# EAGLE schematic DELTA_7_25_2016 (EAGLE 6.3), part 1 of 2

## Sheet 1 of 13
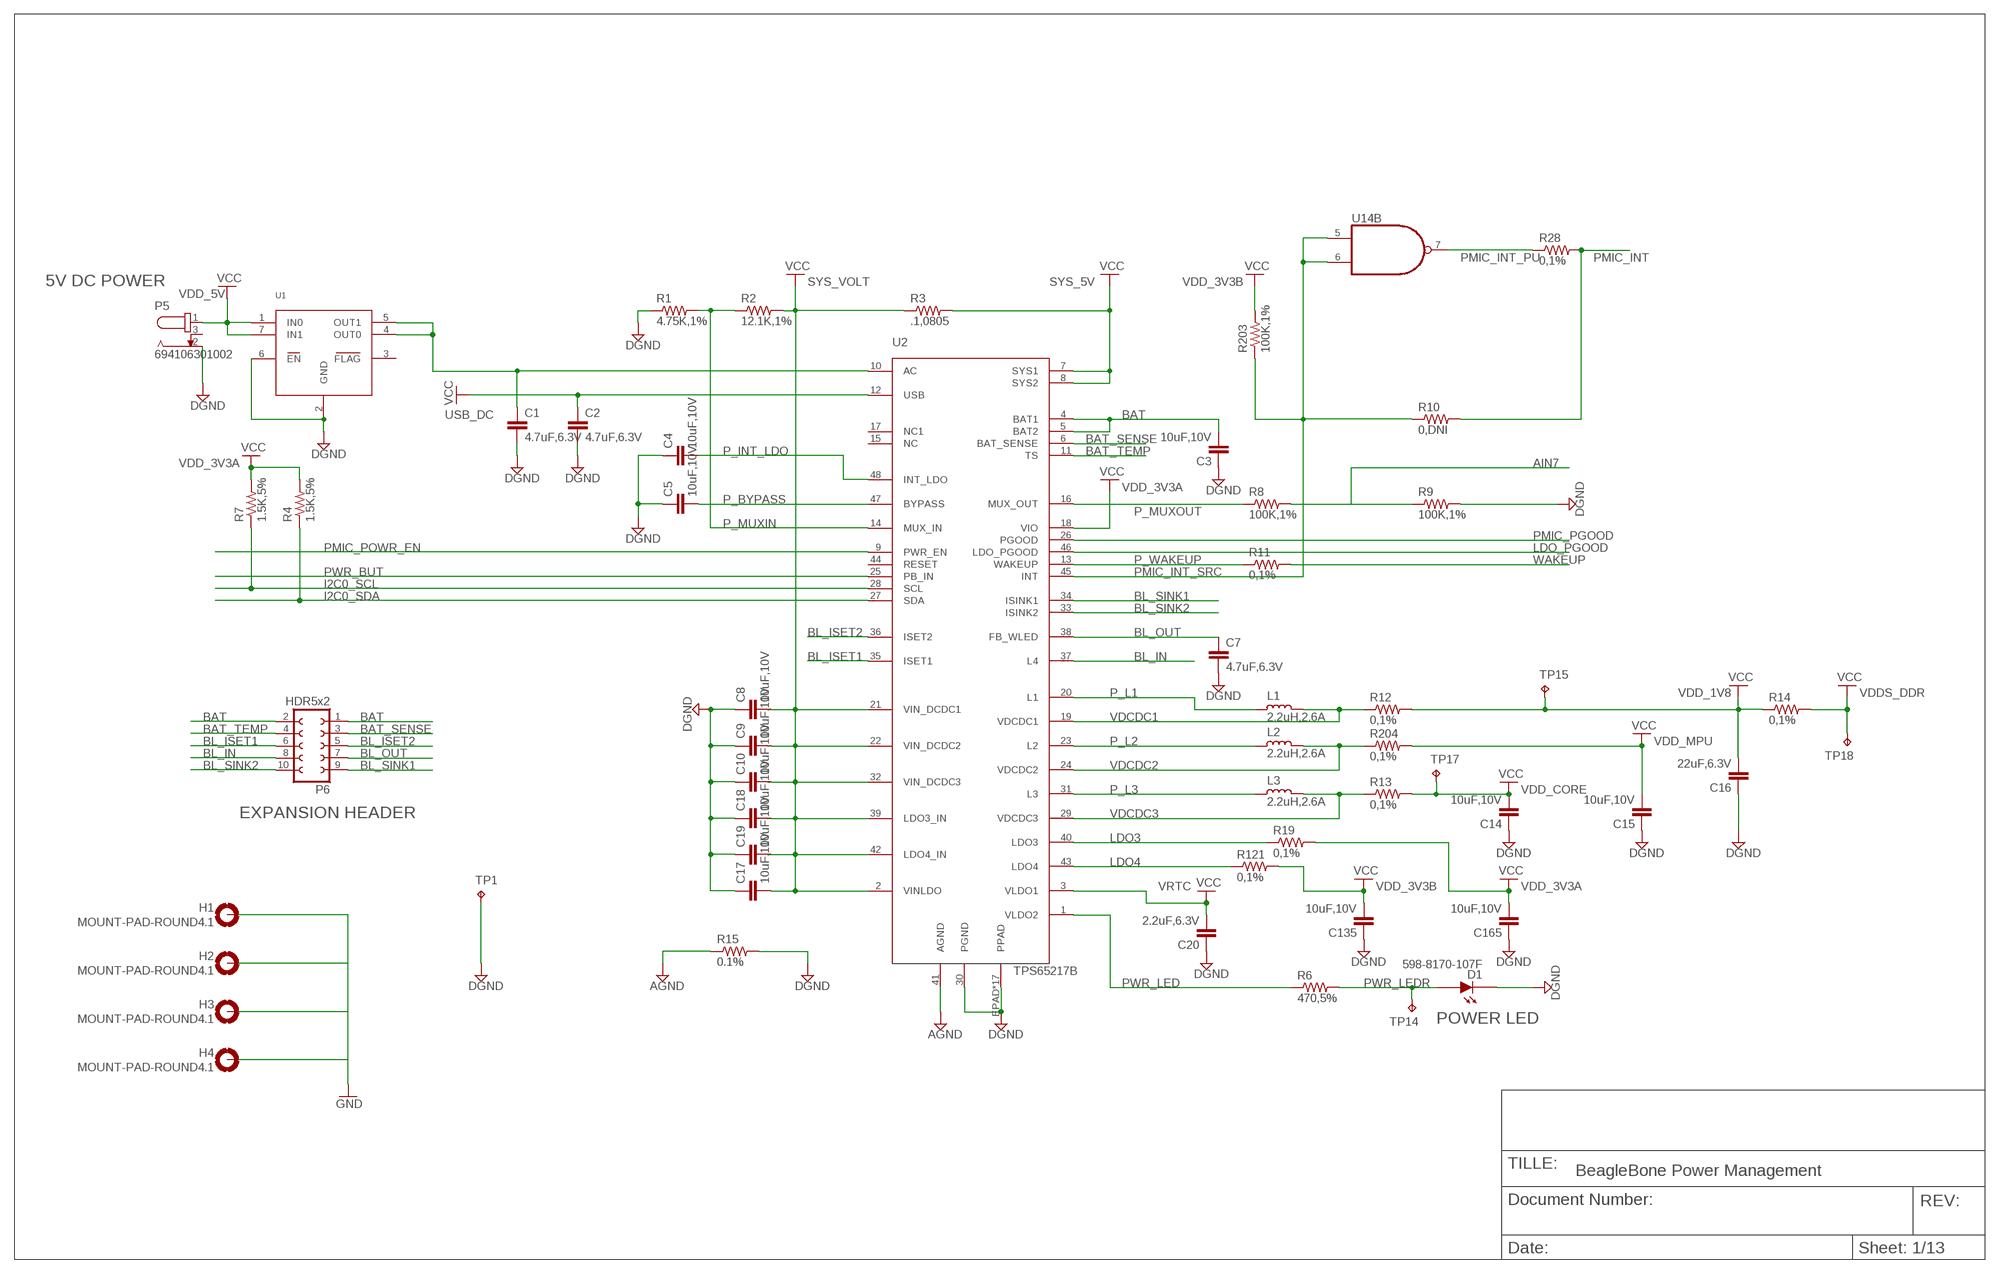
[diagram p0: schematic, sheet 1]

### Parts
C1  4.7uF,6.3V  C-EUC0402  [C0402]
C2  4.7uF,6.3V  C-EUC0402  [C0402]
C3  10uF,10V  C-EUC0402  [C0402]
C4  10uF,10V  C-EUC0402  [C0402]
C5  10uF,10V  C-EUC0402  [C0402]
C7  4.7uF,6.3V  C-EUC0402  [C0402]
C8  10uF,10V  C-EUC0402  [C0402]
C9  10uF,10V  C-EUC0402  [C0402]
C10  10uF,10V  C-EUC0402  [C0402]
C14  10uF,10V  C-EUC0402  [C0402]
C15  10uF,10V  C-EUC0402  [C0402]
C16  22uF,6.3V  C-EUC0402  [C0402]
C17  10uF,10V  C-EUC0402  [C0402]
C18  10uF,10V  C-EUC0402  [C0402]
C19  10uF,10V  C-EUC0402  [C0402]
C20  2.2uF,6.3V  C-EUC0402  [C0402]
C135  10uF,10V  C-EUC0402  [C0402]
C165  10uF,10V  C-EUC0402  [C0402]
D1  598-8170-107F  LEDC  [0805P]
H1  MOUNT-PAD-ROUND4.1  [4,1-PAD]
H2  MOUNT-PAD-ROUND4.1  [4,1-PAD]
H3  MOUNT-PAD-ROUND4.1  [4,1-PAD]
H4  MOUNT-PAD-ROUND4.1  [4,1-PAD]
L1  2.2uH,2.6A  L-EUL1008  [L1008]
L2  2.2uH,2.6A  L-EUL1008  [L1008]
L3  2.2uH,2.6A  L-EUL1008  [L1008]
P5  694106301002  [694106301002]
P6  HDR5x2  FE05-2  [FE05-2]
R1  4.75K,1%  R-US_R0402  [R0402]
R2  12.1K,1%  R-US_R0402  [R0402]
R3  .1,0805  R-US_R0402  [R0402]
R4  1.5K,5%  R-US_R0402  [R0402]
R6  470,5%  R-US_R0402  [R0402]
R7  1.5K,5%  R-US_R0402  [R0402]
R8  100K,1%  R-US_R0402  [R0402]
R9  100K,1%  R-US_R0402  [R0402]
R10  0,DNI  R-US_R0402  [R0402]
R11  0,1%  R-US_R0402  [R0402]
R12  0,1%  R-US_R0402  [R0402]
R13  0,1%  R-US_R0402  [R0402]
R14  0,1%  R-US_R0402  [R0402]
R15  0.1%  R-US_R0402  [R0402]
R19  0,1%  R-US_R0402  [R0402]
R28  0,1%  R-US_R0402  [R0402]
R121  0,1%  R-US_R0402  [R0402]
R203  100K,1%  R-US_R0402  [R0402]
R204  0,1%  R-US_R0402  [R0402]
TP1  TPB1,27  [B1,27]
TP14  TPB1,27  [B1,27]
TP15  TPB1,27  [B1,27]
TP17  TPB1,27  [B1,27]
TP18  TPB1,27  [B1,27]
U1  NCP349  [DFN6]
U2  TPS65217B  [RSL(S-PVQFN-N48)]
U14  SN74LVC2G00DCU  [DCU(S-PDSO-G8)]

### Nets
AGND: R15.1 U2.41(AGND)
AIN7: R8.2 R9.1 ; also sheet 4
BAT: C3.2 P6.1 P6.2 U2.4(BAT1) U2.5(BAT2)
BAT_SENSE: P6.3 U2.6(BAT_SENSE)
BAT_TEMP: P6.4 U2.11(TS)
BL_IN: P6.8 U2.37(L4)
BL_ISET1: P6.6 U2.35(ISET1)
BL_ISET2: P6.5 U2.36(ISET2)
BL_OUT: C7.1 P6.7 U2.38(FB_WLED)
BL_SINK1: P6.9 U2.34(ISINK1)
BL_SINK2: P6.10 U2.33(ISINK2)
DGND: C1.2 C2.2 C3.1 C4.1 C5.1 C7.2 C8.1 C9.1 C10.1 C14.1 C15.1 C16.1 C17.1 C18.1 C19.1 C20.1 C135.1 C165.1 D1.2(D_OUT) P5.2 R1.1 R9.2 R15.2 TP1.TP U1.2(GND) U1.6(EN) U2.30(PGND) U2.EPAD(PPAD) U2.P$1(PPAD) U2.P$2(PPAD) U2.P$3(PPAD) U2.P$4(PPAD) U2.P$5(PPAD) U2.P$6(PPAD) U2.P$7(PPAD) U2.P$8(PPAD) U2.P$9(PPAD) U2.P$10(PPAD) U2.P$11(PPAD) U2.P$12(PPAD) U2.P$13(PPAD) U2.P$14(PPAD) U2.P$15(PPAD) U2.P$16(PPAD) ; also sheet 2,3,5,6,7,8,9,10,11,12,13
GND: H1.B4,1(MOUNT) H2.B4,1(MOUNT) H3.B4,1(MOUNT) H4.B4,1(MOUNT) ; also sheet 7,8,10,11
I2C0_SCL: R7.1 U2.28(SCL) ; also sheet 4,6,11
I2C0_SDA: R4.1 U2.27(SDA) ; also sheet 4,6,11
LDO3: R19.1 U2.40(LDO3)
LDO4: R121.1 U2.43(LDO4)
LDO_PGOOD: U2.46(LDO_PGOOD) ; also sheet 3
N$12: C1.1 U1.4(OUT0) U1.5(OUT1) U2.10(AC)
P_BYPASS: C5.2 U2.47(BYPASS)
P_INT_LDO: C4.2 U2.48(INT_LDO)
P_L1: L1.2 U2.20(L1)
P_L2: L2.2 U2.23(L2)
P_L3: L3.2 U2.31(L3)
P_MUXIN: R1.2 R2.1 U2.14(MUX_IN)
P_MUXOUT: R8.1 U2.16(MUX_OUT)
P_WAKEUP: R11.1 U2.13(WAKEUP)
PMIC_INT: R10.2 R28.2 ; also sheet 3
PMIC_INT_PU: R28.1 U14.7(B:O)
PMIC_INT_SRC: R10.1 R203.1 U2.45(INT) U14.5(B:I0) U14.6(B:I1)
PMIC_PGOOD: U2.26(PGOOD) ; also sheet 3
PMIC_POWR_EN: U2.9(PWR_EN) ; also sheet 4
PWR_BUT: U2.25(PB_IN) ; also sheet 10
PWR_LED: R6.1 U2.1(VLDO2)
PWR_LEDR: D1.1(D_IN) R6.2 TP14.TP
SYS_5V: R3.2 U2.7(SYS1) U2.8(SYS2) ; supply symbol labelled VCC ; also sheet 5,7,8,10,11
SYS_VOLT: C8.2 C9.2 C10.2 C17.2 C18.2 C19.2 R2.2 R3.1 U2.2(VINLDO) U2.21(VIN_DCDC1) U2.22(VIN_DCDC2) U2.32(VIN_DCDC3) U2.39(LDO3_IN) U2.42(LDO4_IN) ; supply symbol labelled VCC ; also sheet 10
USB_DC: C2.1 U2.12(USB) ; supply symbol labelled VCC ; also sheet 8
VDCDC1: L1.1 R12.1 U2.19(VDCDC1)
VDCDC2: L2.1 R204.1 U2.24(VDCDC2)
VDCDC3: L3.1 R13.1 U2.29(VDCDC3)
VDD_1V8: C16.2 R12.2 R14.1 TP15.TP ; supply symbol labelled VCC ; also sheet 2,11
VDD_3V3A: C165.2 R4.2 R7.2 R19.2 U2.18(VIO) ; supply symbol labelled VCC ; also sheet 2,3,5,10
VDD_3V3B: C135.2 R121.2 R203.2 ; supply symbol labelled VCC ; also sheet 4,6,7,8,9,10,11,13
VDD_5V: P5.1 U1.1(IN0) U1.7(IN1) ; supply symbol labelled VCC ; also sheet 10
VDD_CORE: C14.2 R13.2 TP17.TP ; supply symbol labelled VCC ; also sheet 2
VDD_MPU: C15.2 R204.2 ; supply symbol labelled VCC ; also sheet 2
VDDS_DDR: R14.2 TP18.TP ; supply symbol labelled VCC ; also sheet 2,3,6,12
VRTC: C20.2 U2.3(VLDO1) ; supply symbol labelled VCC ; also sheet 2,3,4
WAKEUP: R11.2 ; also sheet 4
Unconnected: P5.3 U1.3(FLAG) U2.15(NC) U2.17(NC1) U2.44(RESET)

### Notes on the sheet
- 5V DC POWER
- EXPANSION HEADER
- POWER LED
- TILLE:
- BeagleBone Power Management
- Document Number: | REV:
- Date: | Sheet: 1/13

## Sheet 2 of 13
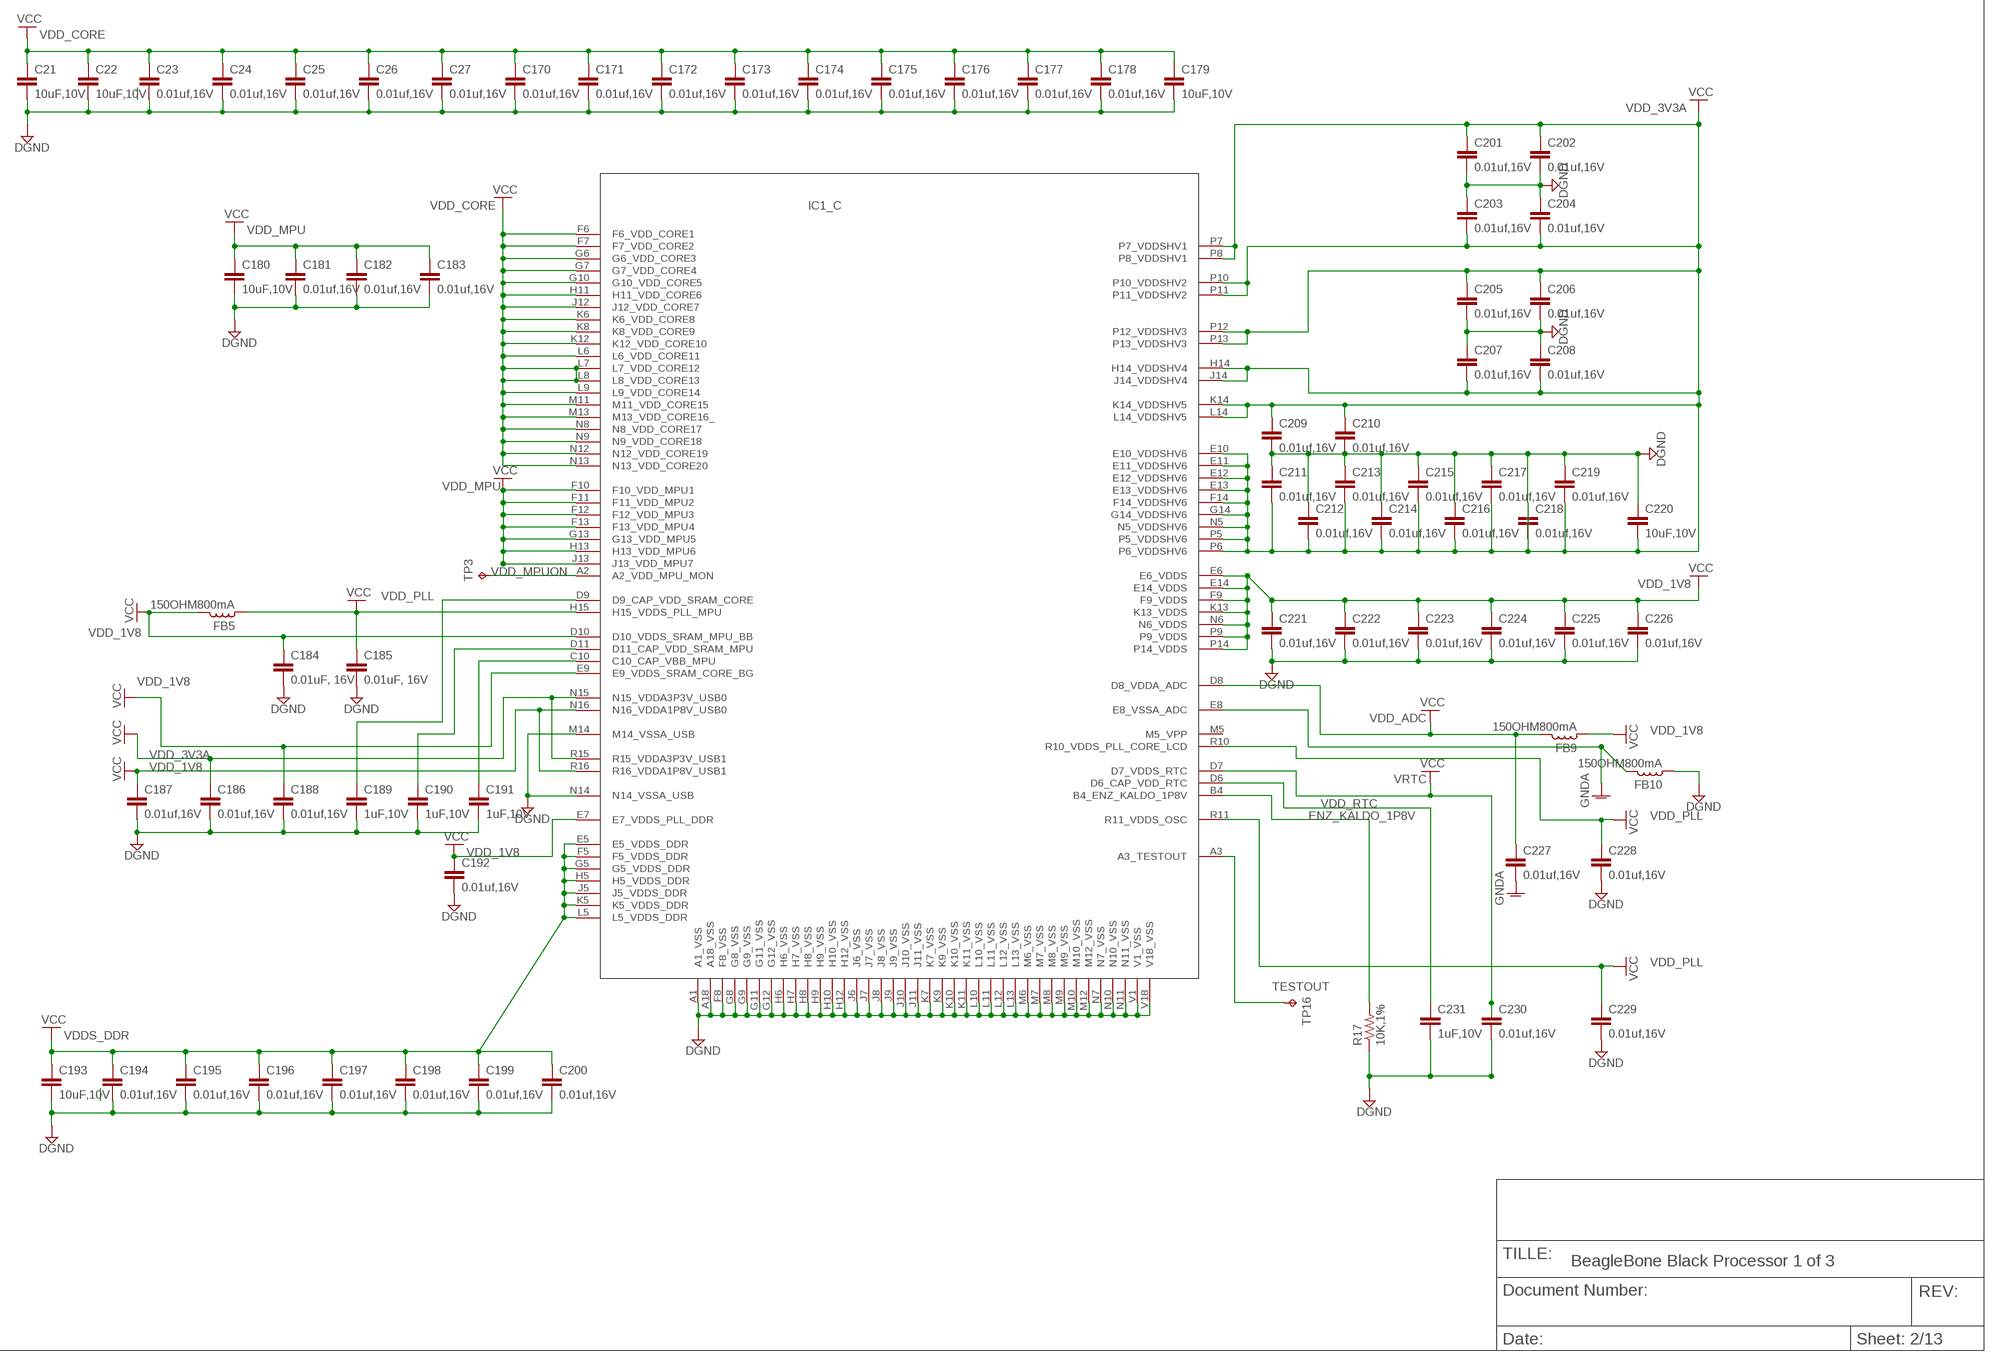
[diagram p1: schematic, sheet 2]

### Parts
C21  10uF,10V  C-EUC0402  [C0402]
C22  10uF,10V  C-EUC0402  [C0402]
C23  0.01uf,16V  C-EUC0402  [C0402]
C24  0.01uf,16V  C-EUC0402  [C0402]
C25  0.01uf,16V  C-EUC0402  [C0402]
C26  0.01uf,16V  C-EUC0402  [C0402]
C27  0.01uf,16V  C-EUC0402  [C0402]
C170  0.01uf,16V  C-EUC0402  [C0402]
C171  0.01uf,16V  C-EUC0402  [C0402]
C172  0.01uf,16V  C-EUC0402  [C0402]
C173  0.01uf,16V  C-EUC0402  [C0402]
C174  0.01uf,16V  C-EUC0402  [C0402]
C175  0.01uf,16V  C-EUC0402  [C0402]
C176  0.01uf,16V  C-EUC0402  [C0402]
C177  0.01uf,16V  C-EUC0402  [C0402]
C178  0.01uf,16V  C-EUC0402  [C0402]
C179  10uF,10V  C-EUC0402  [C0402]
C180  10uF,10V  C-EUC0402  [C0402]
C181  0.01uf,16V  C-EUC0402  [C0402]
C182  0.01uf,16V  C-EUC0402  [C0402]
C183  0.01uf,16V  C-EUC0402  [C0402]
C184  0.01uF, 16V  C-EUC0402  [C0402]
C185  0.01uF, 16V  C-EUC0402  [C0402]
C186  0.01uf,16V  C-EUC0402  [C0402]
C187  0.01uf,16V  C-EUC0402  [C0402]
C188  0.01uf,16V  C-EUC0402  [C0402]
C189  1uF,10V  C-EUC0402  [C0402]
C190  1uF,10V  C-EUC0402  [C0402]
C191  1uF,10V  C-EUC0402  [C0402]
C192  0.01uf,16V  C-EUC0402  [C0402]
C193  10uF,10V  C-EUC0402  [C0402]
C194  0.01uf,16V  C-EUC0402  [C0402]
C195  0.01uf,16V  C-EUC0402  [C0402]
C196  0.01uf,16V  C-EUC0402  [C0402]
C197  0.01uf,16V  C-EUC0402  [C0402]
C198  0.01uf,16V  C-EUC0402  [C0402]
C199  0.01uf,16V  C-EUC0402  [C0402]
C200  0.01uf,16V  C-EUC0402  [C0402]
C201  0.01uf,16V  C-EUC0402  [C0402]
C202  0.01uf,16V  C-EUC0402  [C0402]
C203  0.01uf,16V  C-EUC0402  [C0402]
C204  0.01uf,16V  C-EUC0402  [C0402]
C205  0.01uf,16V  C-EUC0402  [C0402]
C206  0.01uf,16V  C-EUC0402  [C0402]
C207  0.01uf,16V  C-EUC0402  [C0402]
C208  0.01uf,16V  C-EUC0402  [C0402]
C209  0.01uf,16V  C-EUC0402  [C0402]
C210  0.01uf,16V  C-EUC0402  [C0402]
C211  0.01uf,16V  C-EUC0402  [C0402]
C212  0.01uf,16V  C-EUC0402  [C0402]
C213  0.01uf,16V  C-EUC0402  [C0402]
C214  0.01uf,16V  C-EUC0402  [C0402]
C215  0.01uf,16V  C-EUC0402  [C0402]
C216  0.01uf,16V  C-EUC0402  [C0402]
C217  0.01uf,16V  C-EUC0402  [C0402]
C218  0.01uf,16V  C-EUC0402  [C0402]
C219  0.01uf,16V  C-EUC0402  [C0402]
C220  10uF,10V  C-EUC0402  [C0402]
C221  0.01uf,16V  C-EUC0402  [C0402]
C222  0.01uf,16V  C-EUC0402  [C0402]
C223  0.01uf,16V  C-EUC0402  [C0402]
C224  0.01uf,16V  C-EUC0402  [C0402]
C225  0.01uf,16V  C-EUC0402  [C0402]
C226  0.01uf,16V  C-EUC0402  [C0402]
C227  0.01uf,16V  C-EUC0402  [C0402]
C228  0.01uf,16V  C-EUC0402  [C0402]
C229  0.01uf,16V  C-EUC0402  [C0402]
C230  0.01uf,16V  C-EUC0402  [C0402]
C231  1uF,10V  C-EUC0402  [C0402]
FB5  150OHM800mA  L-USL0603  [L0603]
FB9  150OHM800mA  L-USL0603  [L0603]
FB10  150OHM800mA  L-USL1812  [L1812]
IC1  AM335X_ZCZ  [ZCZ_S-PBGA-N324]
R17  10K,1%  R-US_R0402  [R0402]
TP3  TPB1,27  [B1,27]
TP16  TPB1,27  [B1,27]

### Nets
DGND: C21.2 C22.2 C23.2 C24.2 C25.2 C26.2 C27.2 C170.2 C171.2 C172.2 C173.2 C174.2 C175.2 C176.2 C177.2 C178.2 C179.2 C180.2 C181.2 C182.2 C183.2 C184.2 C185.2 C186.2 C187.2 C188.2 C189.2 C190.2 C191.2 C192.2 C193.2 C194.2 C195.2 C196.2 C197.2 C198.2 C199.2 C200.2 C201.2 C202.2 C203.1 C204.1 C205.2 C206.2 C207.1 C208.1 C221.2 C222.2 C223.2 C224.2 C225.2 C226.2 C228.2 C229.2 C230.2 C231.2 FB10.2 IC1.A1(_C:A1_VSS) IC1.A18(_C:A18_VSS) IC1.F8(_C:F8_VSS) IC1.G8(_C:G8_VSS) IC1.G9(_C:G9_VSS) IC1.G11(_C:G11_VSS) IC1.G12(_C:G12_VSS) IC1.H6(_C:H6_VSS) IC1.H7(_C:H7_VSS) IC1.H8(_C:H8_VSS) IC1.H9(_C:H9_VSS) IC1.H10(_C:H10_VSS) IC1.H12(_C:H12_VSS) IC1.J6(_C:J6_VSS) IC1.J7(_C:J7_VSS) IC1.J8(_C:J8_VSS) IC1.J9(_C:J9_VSS) IC1.J10(_C:J10_VSS) IC1.J11(_C:J11_VSS) IC1.K7(_C:K7_VSS) IC1.K9(_C:K9_VSS) IC1.K10(_C:K10_VSS) IC1.K11(_C:K11_VSS) IC1.L10(_C:L10_VSS) IC1.L11(_C:L11_VSS) IC1.L12(_C:L12_VSS) IC1.L13(_C:L13_VSS) IC1.M6(_C:M6_VSS) IC1.M7(_C:M7_VSS) IC1.M8(_C:M8_VSS) IC1.M9(_C:M9_VSS) IC1.M10(_C:M10_VSS) IC1.M12(_C:M12_VSS) IC1.M14(_C:M14_VSSA_USB) IC1.N7(_C:N7_VSS) IC1.N10(_C:N10_VSS) IC1.N11(_C:N11_VSS) IC1.N14(_C:N14_VSSA_USB) IC1.V1(_C:V1_VSS) IC1.V18(_C:V18_VSS) R17.1 ; also sheet 1,3,5,6,7,8,9,10,11,12,13
ENZ_KALDO_1P8V: IC1.B4(_C:B4_ENZ_KALDO_1P8V) R17.2
GNDA: C227.2 FB10.1 IC1.E8(_C:E8_VSSA_ADC) ; also sheet 4,5
N$6: C189.1 IC1.D9(_C:D9_CAP_VDD_SRAM_CORE)
N$16: C190.1 IC1.D11(_C:D11_CAP_VDD_SRAM_MPU)
N$17: C191.1 IC1.C10(_C:C10_CAP_VBB_MPU)
TESTOUT: IC1.A3(_C:A3_TESTOUT) TP16.TP
VDD_1V8: C184.1 C187.1 C188.1 C192.1 C221.1 C222.1 C223.1 C224.1 C225.1 C226.1 FB5.1 FB9.2 IC1.D10(_C:D10_VDDS_SRAM_MPU_BB) IC1.E6(_C:E6_VDDS) IC1.E7(_C:E7_VDDS_PLL_DDR) IC1.E9(_C:E9_VDDS_SRAM_CORE_BG) IC1.E14(_C:E14_VDDS) IC1.F9(_C:F9_VDDS) IC1.K13(_C:K13_VDDS) IC1.N6(_C:N6_VDDS) IC1.N16(_C:N16_VDDA1P8V_USB0) IC1.P9(_C:P9_VDDS) IC1.P14(_C:P14_VDDS) IC1.R16(_C:R16_VDDA1P8V_USB1) ; supply symbol labelled VCC ; also sheet 1,11
VDD_3V3A: C186.1 C201.1 C202.1 C203.2 C204.2 C205.1 C206.1 C207.2 C208.2 C209.1 C209.2 C210.1 C210.2 C211.1 C211.2 C212.1 C212.2 C213.1 C213.2 C214.1 C214.2 C215.1 C215.2 C216.1 C216.2 C217.1 C217.2 C218.1 C218.2 C219.1 C219.2 C220.1 C220.2 IC1.E10(_C:E10_VDDSHV6) IC1.E11(_C:E11_VDDSHV6) IC1.E12(_C:E12_VDDSHV6) IC1.E13(_C:E13_VDDSHV6) IC1.F14(_C:F14_VDDSHV6) IC1.G14(_C:G14_VDDSHV6) IC1.H14(_C:H14_VDDSHV4) IC1.J14(_C:J14_VDDSHV4) IC1.K14(_C:K14_VDDSHV5) IC1.L14(_C:L14_VDDSHV5) IC1.N5(_C:N5_VDDSHV6) IC1.N15(_C:N15_VDDA3P3V_USB0) IC1.P5(_C:P5_VDDSHV6) IC1.P6(_C:P6_VDDSHV6) IC1.P7(_C:P7_VDDSHV1) IC1.P8(_C:P8_VDDSHV1) IC1.P10(_C:P10_VDDSHV2) IC1.P11(_C:P11_VDDSHV2) IC1.P12(_C:P12_VDDSHV3) IC1.P13(_C:P13_VDDSHV3) IC1.R15(_C:R15_VDDA3P3V_USB1) ; supply symbol labelled VCC, DGND ; also sheet 1,3,5,10
VDD_ADC: C227.1 FB9.1 IC1.D8(_C:D8_VDDA_ADC) ; supply symbol labelled VCC ; also sheet 4,10
VDD_CORE: C21.1 C22.1 C23.1 C24.1 C25.1 C26.1 C27.1 C170.1 C171.1 C172.1 C173.1 C174.1 C175.1 C176.1 C177.1 C178.1 C179.1 IC1.F6(_C:F6_VDD_CORE1) IC1.F7(_C:F7_VDD_CORE2) IC1.G6(_C:G6_VDD_CORE3) IC1.G7(_C:G7_VDD_CORE4) IC1.G10(_C:G10_VDD_CORE5) IC1.H11(_C:H11_VDD_CORE6) IC1.J12(_C:J12_VDD_CORE7) IC1.K6(_C:K6_VDD_CORE8) IC1.K8(_C:K8_VDD_CORE9) IC1.K12(_C:K12_VDD_CORE10) IC1.L6(_C:L6_VDD_CORE11) IC1.L7(_C:L7_VDD_CORE12) IC1.L8(_C:L8_VDD_CORE13) IC1.L9(_C:L9_VDD_CORE14) IC1.M11(_C:M11_VDD_CORE15) IC1.M13(_C:M13_VDD_CORE16_) IC1.N8(_C:N8_VDD_CORE17) IC1.N9(_C:N9_VDD_CORE18) IC1.N12(_C:N12_VDD_CORE19) IC1.N13(_C:N13_VDD_CORE20) ; supply symbol labelled VCC ; also sheet 1
VDD_MPU: C180.1 C181.1 C182.1 C183.1 IC1.F10(_C:F10_VDD_MPU1) IC1.F11(_C:F11_VDD_MPU2) IC1.F12(_C:F12_VDD_MPU3) IC1.F13(_C:F13_VDD_MPU4) IC1.G13(_C:G13_VDD_MPU5) IC1.H13(_C:H13_VDD_MPU6) IC1.J13(_C:J13_VDD_MPU7) ; supply symbol labelled VCC ; also sheet 1
VDD_MPUON: IC1.A2(_C:A2_VDD_MPU_MON) TP3.TP
VDD_PLL: C185.1 C228.1 C229.1 FB5.2 IC1.H15(_C:H15_VDDS_PLL_MPU) IC1.R10(_C:R10_VDDS_PLL_CORE_LCD) IC1.R11(_C:R11_VDDS_OSC) ; supply symbol labelled VCC
VDD_RTC: C231.1 IC1.D6(_C:D6_CAP_VDD_RTC)
VDDS_DDR: C193.1 C194.1 C195.1 C196.1 C197.1 C198.1 C199.1 C200.1 IC1.E5(_C:E5_VDDS_DDR) IC1.F5(_C:F5_VDDS_DDR) IC1.G5(_C:G5_VDDS_DDR) IC1.H5(_C:H5_VDDS_DDR) IC1.J5(_C:J5_VDDS_DDR) IC1.K5(_C:K5_VDDS_DDR) IC1.L5(_C:L5_VDDS_DDR) ; supply symbol labelled VCC ; also sheet 1,3,6,12
VRTC: C230.1 IC1.D7(_C:D7_VDDS_RTC) ; supply symbol labelled VCC ; also sheet 1,3,4
Unconnected: IC1.M5(_C:M5_VPP)

### Notes on the sheet
- TILLE:
- BeagleBone Black Processor 1 of 3
- Document Number: | REV:
- Date: | Sheet: 2/13

## Sheet 3 of 13
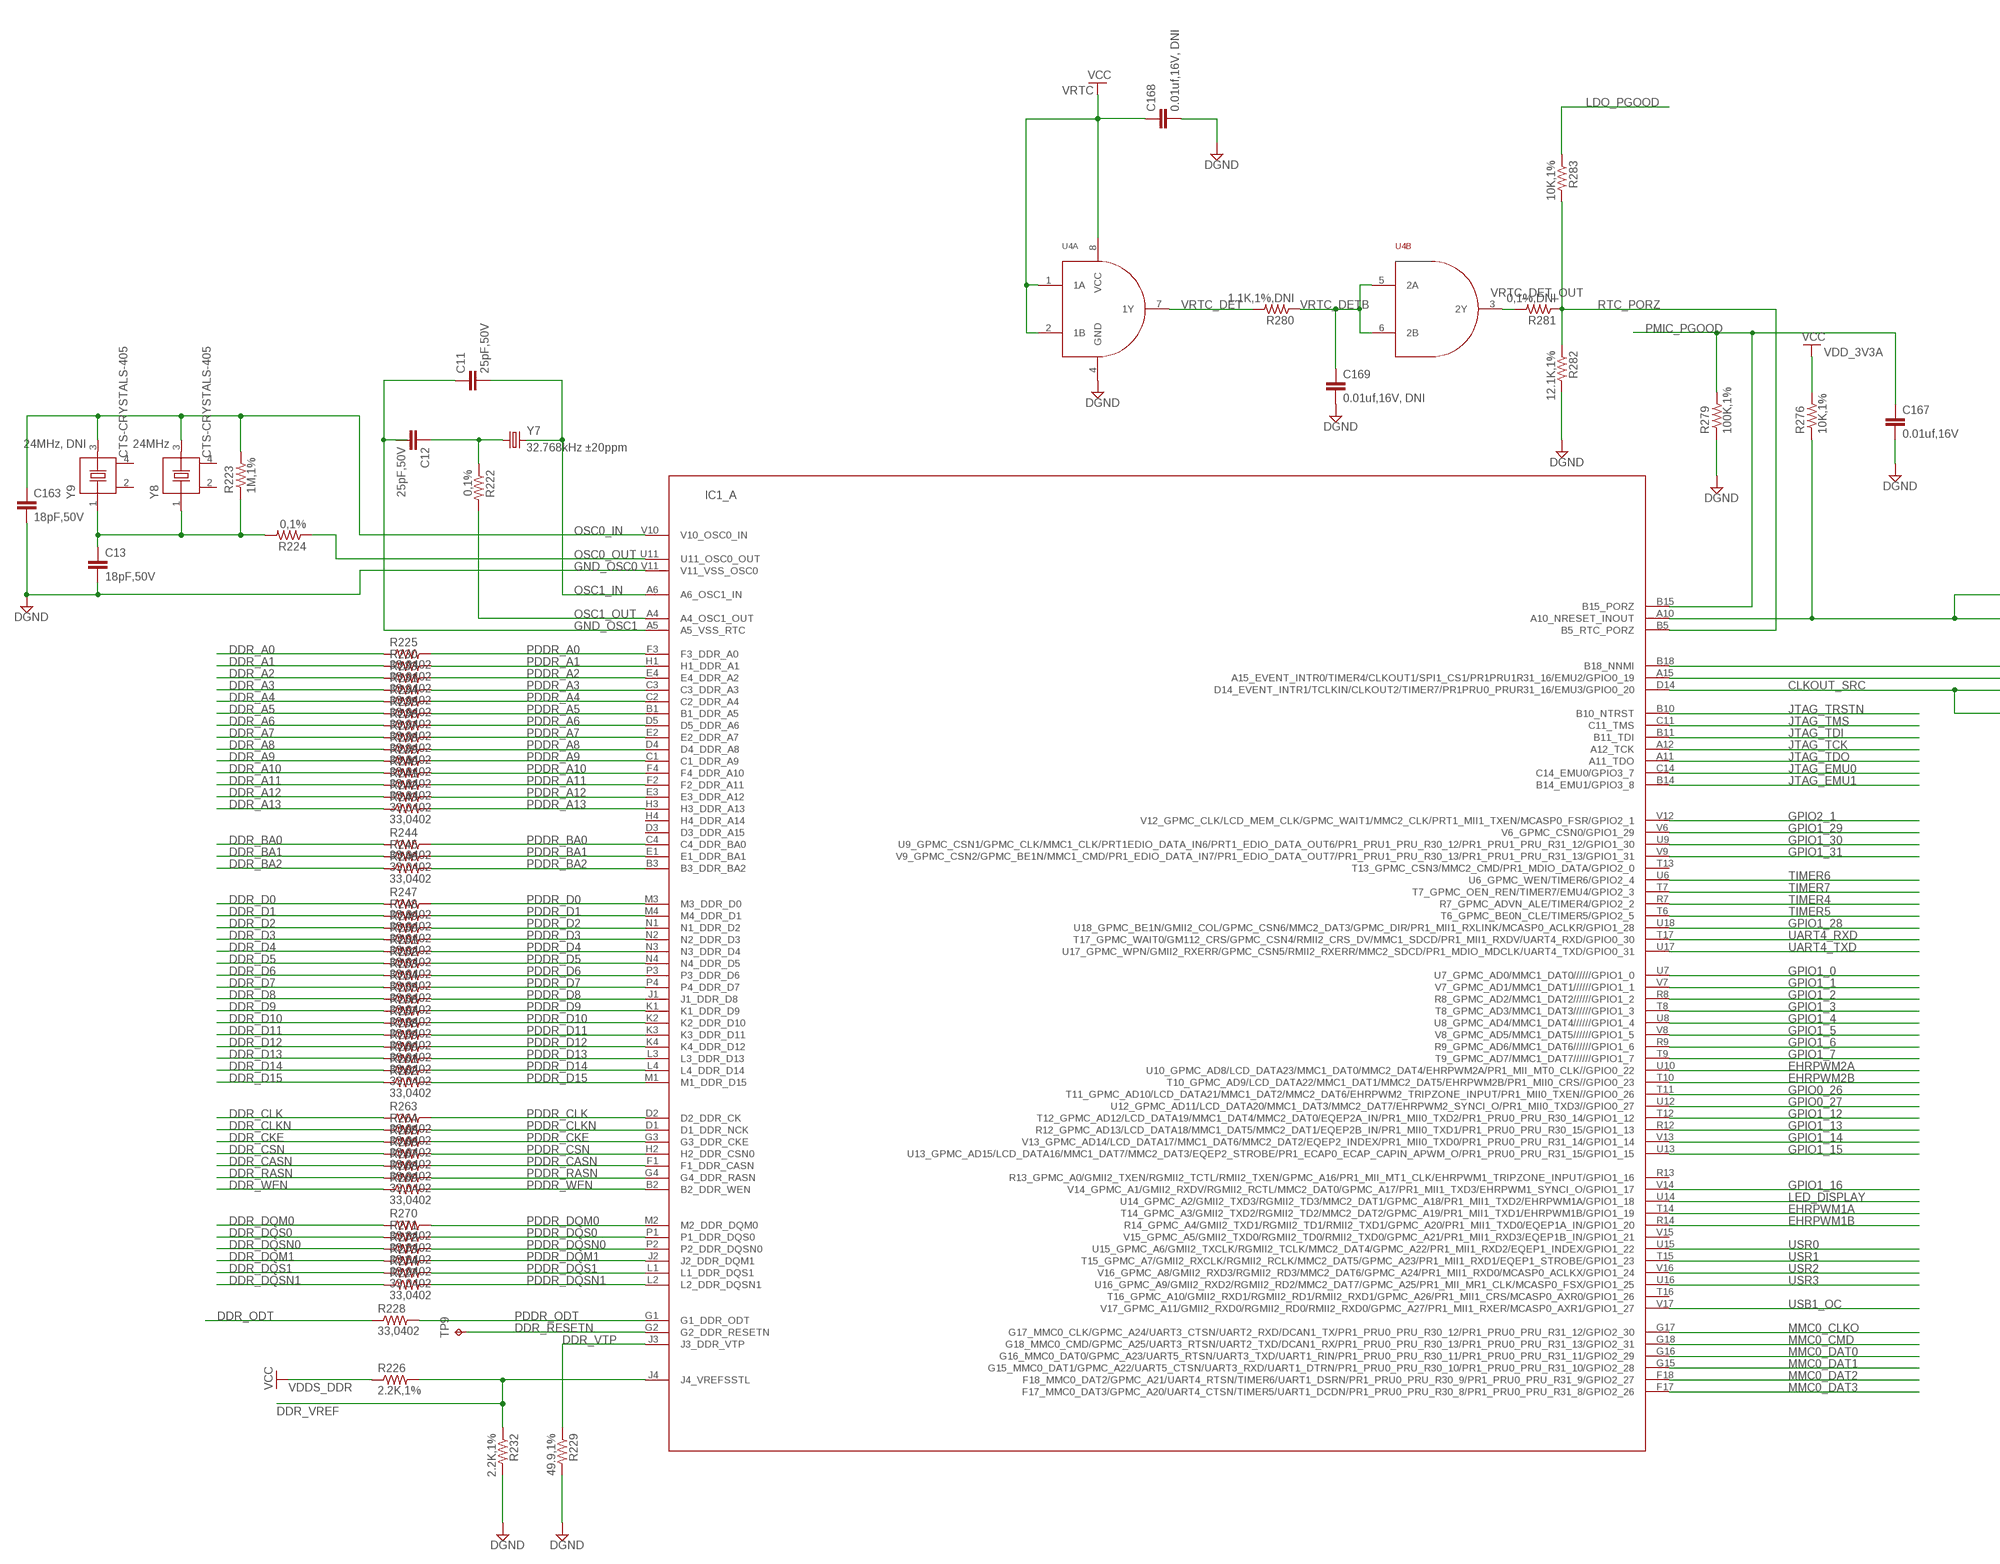
[diagram p2: schematic, sheet 3, part 1 of 2]
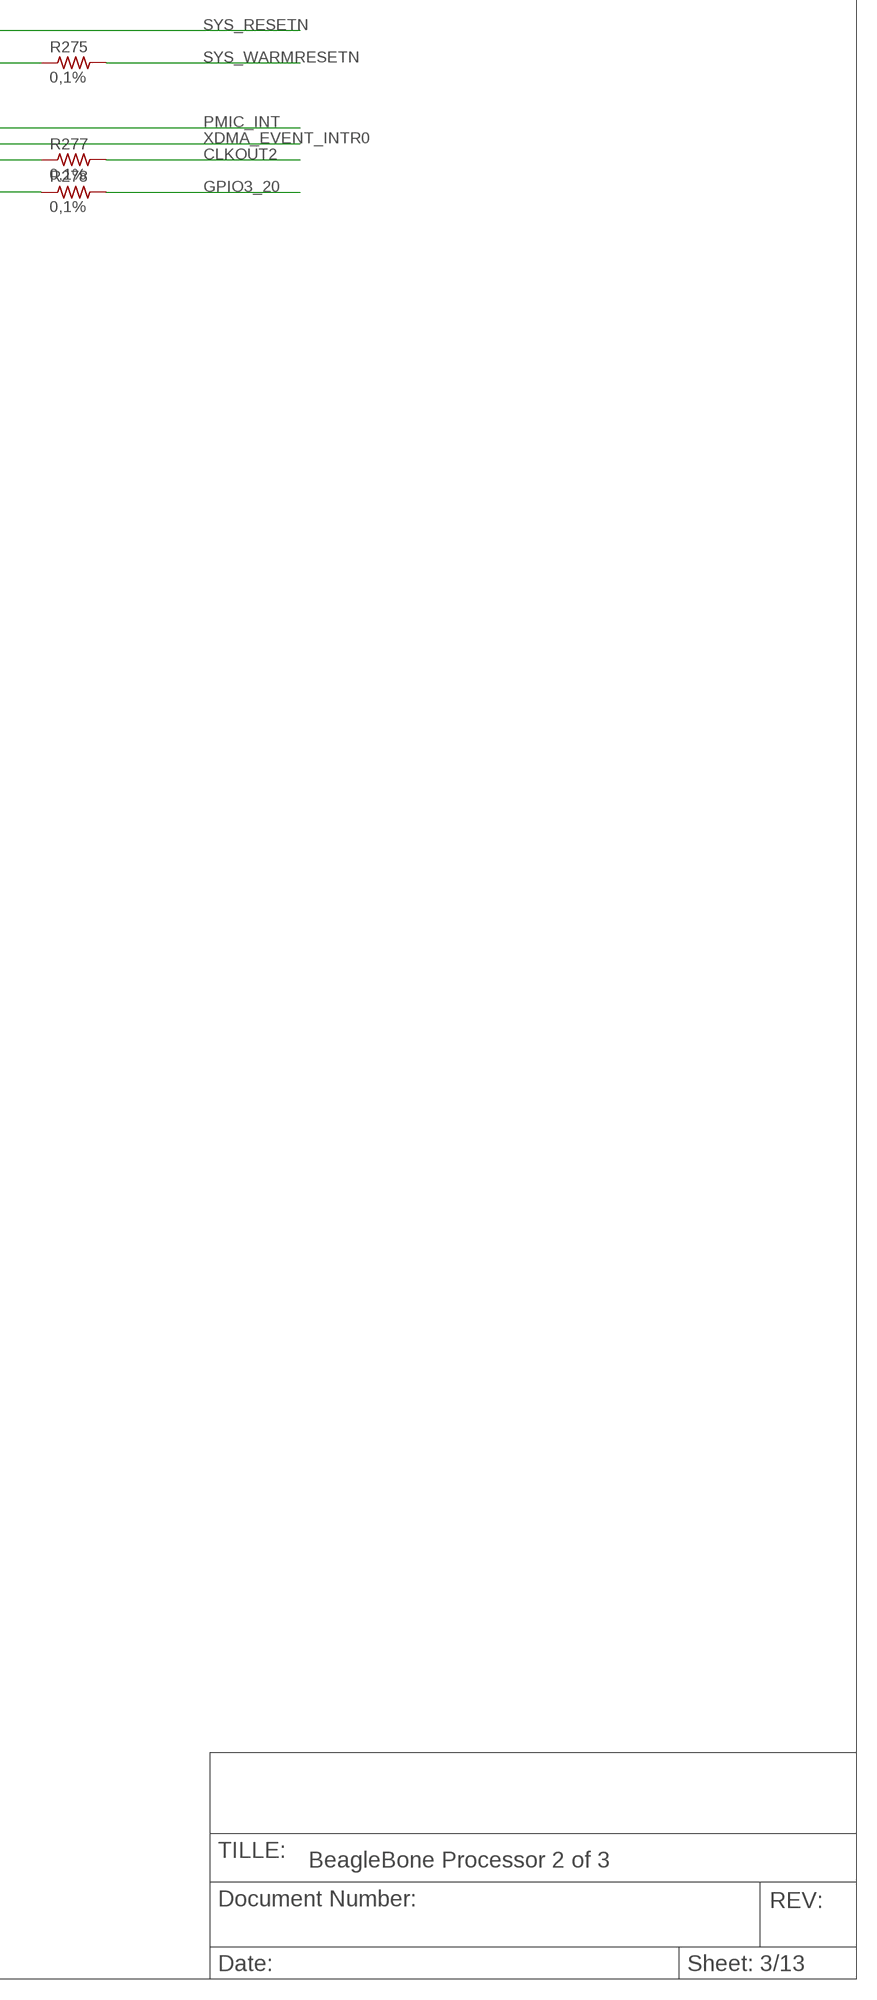
[diagram p3: schematic, sheet 3, part 2 of 2]

### Parts
C11  25pF,50V  C-EUC0603  [C0603]
C12  25pF,50V  C-EUC0603  [C0603]
C13  18pF,50V  C-EUC0402  [C0402]
C163  18pF,50V  C-EUC0402  [C0402]
C167  0.01uf,16V  C-EUC0402  [C0402]
C168  0.01uf,16V, DNI  C-EUC0402  [C0402]
C169  0.01uf,16V, DNI  C-EUC0402  [C0402]
R222  0,1%  R-US_R0402  [R0402]
R223  1M,1%  R-US_R0402  [R0402]
R224  0,1%  R-US_R0402  [R0402]
R225  33,0402  R-US_R0402  [R0402]
R226  2.2K,1%  R-US_R0402  [R0402]
R227  33,0402  R-US_R0402  [R0402]
R228  33,0402  R-US_R0402  [R0402]
R229  49.9,1%  R-US_R0402  [R0402]
R230  33,0402  R-US_R0402  [R0402]
R231  33,0402  R-US_R0402  [R0402]
R232  2.2K,1%  R-US_R0402  [R0402]
R233  33,0402  R-US_R0402  [R0402]
R234  33,0402  R-US_R0402  [R0402]
R235  33,0402  R-US_R0402  [R0402]
R236  33,0402  R-US_R0402  [R0402]
R237  33,0402  R-US_R0402  [R0402]
R238  33,0402  R-US_R0402  [R0402]
R239  33,0402  R-US_R0402  [R0402]
R240  33,0402  R-US_R0402  [R0402]
R241  33,0402  R-US_R0402  [R0402]
R242  33,0402  R-US_R0402  [R0402]
R243  33,0402  R-US_R0402  [R0402]
R244  33,0402  R-US_R0402  [R0402]
R245  33,0402  R-US_R0402  [R0402]
R246  33,0402  R-US_R0402  [R0402]
R247  33,0402  R-US_R0402  [R0402]
R248  33,0402  R-US_R0402  [R0402]
R249  33,0402  R-US_R0402  [R0402]
R250  33,0402  R-US_R0402  [R0402]
R251  33,0402  R-US_R0402  [R0402]
R252  33,0402  R-US_R0402  [R0402]
R253  33,0402  R-US_R0402  [R0402]
R254  33,0402  R-US_R0402  [R0402]
R255  33,0402  R-US_R0402  [R0402]
R256  33,0402  R-US_R0402  [R0402]
R257  33,0402  R-US_R0402  [R0402]
R258  33,0402  R-US_R0402  [R0402]
R259  33,0402  R-US_R0402  [R0402]
R260  33,0402  R-US_R0402  [R0402]
R261  33,0402  R-US_R0402  [R0402]
R262  33,0402  R-US_R0402  [R0402]
R263  33,0402  R-US_R0402  [R0402]
R264  33,0402  R-US_R0402  [R0402]
R265  33,0402  R-US_R0402  [R0402]
R266  33,0402  R-US_R0402  [R0402]
R267  33,0402  R-US_R0402  [R0402]
R268  33,0402  R-US_R0402  [R0402]
R269  33,0402  R-US_R0402  [R0402]
R270  33,0402  R-US_R0402  [R0402]
R271  33,0402  R-US_R0402  [R0402]
R272  33,0402  R-US_R0402  [R0402]
R273  33,0402  R-US_R0402  [R0402]
R274  33,0402  R-US_R0402  [R0402]
R275  0,1%  R-US_R0402  [R0402]
R276  10K,1%  R-US_R0402  [R0402]
R277  0,1%  R-US_R0402  [R0402]
R278  0,1%  R-US_R0402  [R0402]
R279  100K,1%  R-US_R0402  [R0402]
R280  1.1K,1%,DNI  R-US_R0402  [R0402]
R281  0,1%,DNI  R-US_R0402  [R0402]
R282  12.1K,1%  R-US_R0402  [R0402]
R283  10K,1%  R-US_R0402  [R0402]
TP9  TPB1,27  [B1,27]
U4  SN74AUP2G08,DNI  [DQE(R-PX2SON-N8),DNI]
Y7  32.768kHz ±20ppm  CRYSTALMC-306  [MC-306]
Y8  CTS-CRYSTALS-405  [CTS-405]
Y9  CTS-CRYSTALS-405  [CTS-405]

### Nets
CLKOUT2: R277.2 ; also sheet 9,10
CLKOUT_SRC: IC1.D14(_A:D14_EVENT_INTR1/TCLKIN/CLKOUT2/TIMER7/PR1PRU0_PRUR31_16/EMU3/GPIO0_20) R277.1 R278.1
DDR_A0: R225.1 ; also sheet 6,12
DDR_A1: R230.1 ; also sheet 6,12
DDR_A2: R233.1 ; also sheet 6,12
DDR_A3: R231.1 ; also sheet 6,12
DDR_A4: R234.1 ; also sheet 6,12
DDR_A5: R235.1 ; also sheet 6,12
DDR_A6: R236.1 ; also sheet 6,12
DDR_A7: R237.1 ; also sheet 6,12
DDR_A8: R238.1 ; also sheet 6,12
DDR_A9: R239.1 ; also sheet 6,12
DDR_A10: R240.1 ; also sheet 6,12
DDR_A11: R241.1 ; also sheet 6,12
DDR_A12: R242.1 ; also sheet 6,12
DDR_A13: R243.1 ; also sheet 6,12
DDR_BA0: R244.1 ; also sheet 6,12
DDR_BA1: R245.1 ; also sheet 6,12
DDR_BA2: R246.1 ; also sheet 6,12
DDR_CASN: R267.1 ; also sheet 6,12
DDR_CKE: R265.1 ; also sheet 6,12
DDR_CLK: R263.1 ; also sheet 6,12
DDR_CLKN: R264.1 ; also sheet 6,12
DDR_CSN: R266.1 ; also sheet 6,12
DDR_D0: R247.1 ; also sheet 6,12
DDR_D1: R248.1 ; also sheet 6,12
DDR_D2: R249.1 ; also sheet 6,12
DDR_D3: R250.1 ; also sheet 6,12
DDR_D4: R251.1 ; also sheet 6,12
DDR_D5: R252.1 ; also sheet 6,12
DDR_D6: R253.1 ; also sheet 6,12
DDR_D7: R254.1 ; also sheet 6,12
DDR_D8: R255.1 ; also sheet 6,12
DDR_D9: R256.1 ; also sheet 6,12
DDR_D10: R257.1 ; also sheet 6,12
DDR_D11: R258.1 ; also sheet 6,12
DDR_D12: R259.1 ; also sheet 6,12
DDR_D13: R260.1 ; also sheet 6,12
DDR_D14: R261.1 ; also sheet 6,12
DDR_D15: R262.1 ; also sheet 6,12
DDR_DQM0: R270.1 ; also sheet 6,12
DDR_DQM1: R273.1 ; also sheet 6,12
DDR_DQS0: R271.1 ; also sheet 6,12
DDR_DQS1: R274.1 ; also sheet 6,12
DDR_DQSN0: R272.1 ; also sheet 6,12
DDR_DQSN1: R227.1 ; also sheet 6,12
DDR_ODT: R228.1 ; also sheet 6,12
DDR_RASN: R268.1 ; also sheet 6,12
DDR_RESETN: IC1.G2(_A:G2_DDR_RESETN) TP9.TP ; also sheet 12
DDR_VREF: IC1.J4(_A:J4_VREFSSTL) R226.2 R232.1 ; also sheet 6,12
DDR_VTP: IC1.J3(_A:J3_DDR_VTP) R229.1
DDR_WEN: R269.1 ; also sheet 6,12
DGND: C167.2 C168.2 C169.2 R229.2 R232.2 R279.1 R282.2 U4.4(A:GND) ; also sheet 1,2,5,6,7,8,9,10,11,12,13
EHRPWM1A: IC1.T14(_A:T14_GPMC_A3/GMII2_TXD2/RGMII2_TD2/MMC2_DAT2/GPMC_A19/PR1_MII1_TXD1/EHRPWM1B/GPIO1_19) ; also sheet 10
EHRPWM1B: IC1.R14(_A:R14_GPMC_A4/GMII2_TXD1/RGMII2_TD1/RMII2_TXD1/GPMC_A20/PR1_MII1_TXD0/EQEP1A_IN/GPIO1_20) ; also sheet 10
EHRPWM2A: IC1.U10(_A:U10_GPMC_AD8/LCD_DATA23/MMC1_DAT0/MMC2_DAT4/EHRPWM2A/PR1_MII_MT0_CLK//GPIO0_22) ; also sheet 10
EHRPWM2B: IC1.T10(_A:T10_GPMC_AD9/LCD_DATA22/MMC1_DAT1/MMC2_DAT5/EHRPWM2B/PR1_MII0_CRS//GPIO0_23) ; also sheet 10
GND_OSC0: C13.2 C163.2 IC1.V11(_A:V11_VSS_OSC0) ; supply symbol labelled DGND
GND_OSC1: C11.1 C12.2 IC1.A5(_A:A5_VSS_RTC)
GPIO0_26: IC1.T11(_A:T11_GPMC_AD10/LCD_DATA21/MMC1_DAT2/MMC2_DAT6/EHRPWM2_TRIPZONE_INPUT/PR1_MII0_TXEN//GPIO0_26) ; also sheet 10
GPIO0_27: IC1.U12(_A:U12_GPMC_AD11/LCD_DATA20/MMC1_DAT3/MMC2_DAT7/EHRPWM2_SYNCI_O/PR1_MII0_TXD3//GPIO0_27) ; also sheet 10
GPIO1_0: IC1.U7(_A:U7_GPMC_AD0/MMC1_DAT0//////GPIO1_0) ; also sheet 10
GPIO1_1: IC1.V7(_A:V7_GPMC_AD1/MMC1_DAT1//////GPIO1_1) ; also sheet 10
GPIO1_2: IC1.R8(_A:R8_GPMC_AD2/MMC1_DAT2//////GPIO1_2) ; also sheet 10
GPIO1_3: IC1.T8(_A:T8_GPMC_AD3/MMC1_DAT3//////GPIO1_3) ; also sheet 10
GPIO1_4: IC1.U8(_A:U8_GPMC_AD4/MMC1_DAT4//////GPIO1_4) ; also sheet 10
GPIO1_5: IC1.V8(_A:V8_GPMC_AD5/MMC1_DAT5//////GPIO1_5) ; also sheet 10
GPIO1_6: IC1.R9(_A:R9_GPMC_AD6/MMC1_DAT6//////GPIO1_6) ; also sheet 10
GPIO1_7: IC1.T9(_A:T9_GPMC_AD7/MMC1_DAT7//////GPIO1_7) ; also sheet 10
GPIO1_12: IC1.T12(_A:T12_GPMC_AD12/LCD_DATA19/MMC1_DAT4/MMC2_DAT0/EQEP2A_IN/PR1_MII0_TXD2/PR1_PRU0_PRU_R30_14/GPIO1_12) ; also sheet 10
GPIO1_13: IC1.R12(_A:R12_GPMC_AD13/LCD_DATA18/MMC1_DAT5/MMC2_DAT1/EQEP2B_IN/PR1_MII0_TXD1/PR1_PRU0_PRU_R30_15/GPIO1_13) ; also sheet 10
GPIO1_14: IC1.V13(_A:V13_GPMC_AD14/LCD_DATA17/MMC1_DAT6/MMC2_DAT2/EQEP2_INDEX/PR1_MII0_TXD0/PR1_PRU0_PRU_R31_14/GPIO1_14) ; also sheet 10
GPIO1_15: IC1.U13(_A:U13_GPMC_AD15/LCD_DATA16/MMC1_DAT7/MMC2_DAT3/EQEP2_STROBE/PR1_ECAP0_ECAP_CAPIN_APWM_O/PR1_PRU0_PRU_R31_15/GPIO1_15) ; also sheet 10
GPIO1_16: IC1.V14(_A:V14_GPMC_A1/GMII2_RXDV/RGMII2_RCTL/MMC2_DAT0/GPMC_A17/PR1_MII1_TXD3/EHRPWM1_SYNCI_O/GPIO1_17) ; also sheet 10
GPIO1_28: IC1.U18(_A:U18_GPMC_BE1N/GMII2_COL/GPMC_CSN6/MMC2_DAT3/GPMC_DIR/PR1_MII1_RXLINK/MCASP0_ACLKR/GPIO1_28) ; also sheet 10
GPIO1_29: IC1.V6(_A:V6_GPMC_CSN0/GPIO1_29) ; also sheet 10
GPIO1_30: IC1.U9(_A:U9_GPMC_CSN1/GPMC_CLK/MMC1_CLK/PRT1EDIO_DATA_IN6/PRT1_EDIO_DATA_OUT6/PR1_PRU1_PRU_R30_12/PR1_PRU1_PRU_R31_12/GPIO1_30) ; also sheet 10
GPIO1_31: IC1.V9(_A:V9_GPMC_CSN2/GPMC_BE1N/MMC1_CMD/PR1_EDIO_DATA_IN7/PR1_EDIO_DATA_OUT7/PR1_PRU1_PRU_R30_13/PR1_PRU1_PRU_R31_13/GPIO1_31) ; also sheet 10
GPIO2_1: IC1.V12(_A:V12_GPMC_CLK/LCD_MEM_CLK/GPMC_WAIT1/MMC2_CLK/PRT1_MII1_TXEN/MCASP0_FSR/GPIO2_1) ; also sheet 10
GPIO3_20: R278.2 ; also sheet 4
JTAG_EMU0: IC1.C14(_A:C14_EMU0/GPIO3_7) ; also sheet 9
JTAG_EMU1: IC1.B14(_A:B14_EMU1/GPIO3_8) ; also sheet 9
JTAG_TCK: IC1.A12(_A:A12_TCK) ; also sheet 9
JTAG_TDI: IC1.B11(_A:B11_TDI) ; also sheet 9
JTAG_TDO: IC1.A11(_A:A11_TDO) ; also sheet 9
JTAG_TMS: IC1.C11(_A:C11_TMS) ; also sheet 9
JTAG_TRSTN: IC1.B10(_A:B10_NTRST) ; also sheet 9
LDO_PGOOD: R283.1 ; also sheet 1
LED_DISPLAY: IC1.U14(_A:U14_GPMC_A2/GMII2_TXD3/RGMII2_TD3/MMC2_DAT1/GPMC_A18/PR1_MII1_TXD2/EHRPWM1A/GPIO1_18) ; also sheet 10,13
MMC0_CLKO: IC1.G17(_A:G17_MMC0_CLK/GPMC_A24/UART3_CTSN/UART2_RXD/DCAN1_TX/PR1_PRU0_PRU_R30_12/PR1_PRU0_PRU_R31_12/GPIO2_30) ; also sheet 10
MMC0_CMD: IC1.G18(_A:G18_MMC0_CMD/GPMC_A25/UART3_RTSN/UART2_TXD/DCAN1_RX/PR1_PRU0_PRU_R30_13/PR1_PRU0_PRU_R31_13/GPIO2_31) ; also sheet 10
MMC0_DAT0: IC1.G16(_A:G16_MMC0_DAT0/GPMC_A23/UART5_RTSN/UART3_TXD/UART1_RIN/PR1_PRU0_PRU_R30_11/PR1_PRU0_PRU_R31_11/GPIO2_29) ; also sheet 10
MMC0_DAT1: IC1.G15(_A:G15_MMC0_DAT1/GPMC_A22/UART5_CTSN/UART3_RXD/UART1_DTRN/PR1_PRU0_PRU_R30_10/PR1_PRU0_PRU_R31_10/GPIO2_28) ; also sheet 10
MMC0_DAT2: IC1.F18(_A:F18_MMC0_DAT2/GPMC_A21/UART4_RTSN/TIMER6/UART1_DSRN/PR1_PRU0_PRU_R30_9/PR1_PRU0_PRU_R31_9/GPIO2_27) ; also sheet 10
MMC0_DAT3: IC1.F17(_A:F17_MMC0_DAT3/GPMC_A20/UART4_CTSN/TIMER5/UART1_DCDN/PR1_PRU0_PRU_R30_8/PR1_PRU0_PRU_R31_8/GPIO2_26) ; also sheet 10
N$14: C12.1 R222.1 Y7.1
N$15: C13.1 R223.1 R224.2 Y8.1 Y9.1
OSC0_IN: C163.1 IC1.V10(_A:V10_OSC0_IN) R223.2 Y8.3 Y9.3
OSC0_OUT: IC1.U11(_A:U11_OSC0_OUT) R224.1
OSC1_IN: C11.2 IC1.A6(_A:A6_OSC1_IN) Y7.4
OSC1_OUT: IC1.A4(_A:A4_OSC1_OUT) R222.2
PDDR_A0: IC1.F3(_A:F3_DDR_A0) R225.2
PDDR_A1: IC1.H1(_A:H1_DDR_A1) R230.2
PDDR_A2: IC1.E4(_A:E4_DDR_A2) R233.2
PDDR_A3: IC1.C3(_A:C3_DDR_A3) R231.2
PDDR_A4: IC1.C2(_A:C2_DDR_A4) R234.2
PDDR_A5: IC1.B1(_A:B1_DDR_A5) R235.2
PDDR_A6: IC1.D5(_A:D5_DDR_A6) R236.2
PDDR_A7: IC1.E2(_A:E2_DDR_A7) R237.2
PDDR_A8: IC1.D4(_A:D4_DDR_A8) R238.2
PDDR_A9: IC1.C1(_A:C1_DDR_A9) R239.2
PDDR_A10: IC1.F4(_A:F4_DDR_A10) R240.2
PDDR_A11: IC1.F2(_A:F2_DDR_A11) R241.2
PDDR_A12: IC1.E3(_A:E3_DDR_A12) R242.2
PDDR_A13: IC1.H3(_A:H3_DDR_A13) R243.2
PDDR_BA0: IC1.C4(_A:C4_DDR_BA0) R244.2
PDDR_BA1: IC1.E1(_A:E1_DDR_BA1) R245.2
PDDR_BA2: IC1.B3(_A:B3_DDR_BA2) R246.2
PDDR_CASN: IC1.F1(_A:F1_DDR_CASN) R267.2
PDDR_CKE: IC1.G3(_A:G3_DDR_CKE) R265.2
PDDR_CLK: IC1.D2(_A:D2_DDR_CK) R263.2
PDDR_CLKN: IC1.D1(_A:D1_DDR_NCK) R264.2
PDDR_CSN: IC1.H2(_A:H2_DDR_CSN0) R266.2
PDDR_D0: IC1.M3(_A:M3_DDR_D0) R247.2
PDDR_D1: IC1.M4(_A:M4_DDR_D1) R248.2
PDDR_D2: IC1.N1(_A:N1_DDR_D2) R249.2
PDDR_D3: IC1.N2(_A:N2_DDR_D3) R250.2
PDDR_D4: IC1.N3(_A:N3_DDR_D4) R251.2
PDDR_D5: IC1.N4(_A:N4_DDR_D5) R252.2
PDDR_D6: IC1.P3(_A:P3_DDR_D6) R253.2
PDDR_D7: IC1.P4(_A:P4_DDR_D7) R254.2
PDDR_D8: IC1.J1(_A:J1_DDR_D8) R255.2
PDDR_D9: IC1.K1(_A:K1_DDR_D9) R256.2
PDDR_D10: IC1.K2(_A:K2_DDR_D10) R257.2
PDDR_D11: IC1.K3(_A:K3_DDR_D11) R258.2
PDDR_D12: IC1.K4(_A:K4_DDR_D12) R259.2
PDDR_D13: IC1.L3(_A:L3_DDR_D13) R260.2
PDDR_D14: IC1.L4(_A:L4_DDR_D14) R261.2
PDDR_D15: IC1.M1(_A:M1_DDR_D15) R262.2
PDDR_DQM0: IC1.M2(_A:M2_DDR_DQM0) R270.2
PDDR_DQM1: IC1.J2(_A:J2_DDR_DQM1) R273.2
PDDR_DQS0: IC1.P1(_A:P1_DDR_DQS0) R271.2
PDDR_DQS1: IC1.L1(_A:L1_DDR_DQS1) R274.2
PDDR_DQSN0: IC1.P2(_A:P2_DDR_DQSN0) R272.2
PDDR_DQSN1: IC1.L2(_A:L2_DDR_DQSN1) R227.2
PDDR_ODT: IC1.G1(_A:G1_DDR_ODT) R228.2
PDDR_RASN: IC1.G4(_A:G4_DDR_RASN) R268.2
PDDR_WEN: IC1.B2(_A:B2_DDR_WEN) R269.2
PMIC_INT: IC1.B18(_A:B18_NNMI) ; also sheet 1
PMIC_PGOOD: C167.1 IC1.B15(_A:B15_PORZ) R279.2 ; also sheet 1
RTC_PORZ: IC1.B5(_A:B5_RTC_PORZ) R281.1 R282.1 R283.2
SYS_RESETN: IC1.A10(_A:A10_NRESET_INOUT) R275.1 R276.1 ; also sheet 7,10
SYS_WARMRESETN: R275.2 ; also sheet 5,9
TIMER4: IC1.R7(_A:R7_GPMC_ADVN_ALE/TIMER4/GPIO2_2) ; also sheet 10
TIMER5: IC1.T6(_A:T6_GPMC_BE0N_CLE/TIMER5/GPIO2_5) ; also sheet 10
TIMER6: IC1.U6(_A:U6_GPMC_WEN/TIMER6/GPIO2_4) ; also sheet 10
TIMER7: IC1.T7(_A:T7_GPMC_OEN_REN/TIMER7/EMU4/GPIO2_3) ; also sheet 10
UART4_RXD: IC1.T17(_A:T17_GPMC_WAIT0/GM112_CRS/GPMC_CSN4/RMII2_CRS_DV/MMC1_SDCD/PR1_MII1_RXDV/UART4_RXD/GPIO0_30) ; also sheet 10
UART4_TXD: IC1.U17(_A:U17_GPMC_WPN/GMII2_RXERR/GPMC_CSN5/RMII2_RXERR/MMC2_SDCD/PR1_MDIO_MDCLK/UART4_TXD/GPIO0_31) ; also sheet 10
USB1_OC: IC1.V17(_A:V17_GPMC_A11/GMII2_RXD0/RGMII2_RD0/RMII2_RXD0/GPMC_A27/PR1_MII1_RXER/MCASP0_AXR1/GPIO1_27) ; also sheet 7
USR0: IC1.U15(_A:U15_GPMC_A6/GMII2_TXCLK/RGMII2_TCLK/MMC2_DAT4/GPMC_A22/PR1_MII1_RXD2/EQEP1_INDEX/GPIO1_22) ; also sheet 5
USR1: IC1.T15(_A:T15_GPMC_A7/GMII2_RXCLK/RGMII2_RCLK/MMC2_DAT5/GPMC_A23/PR1_MII1_RXD1/EQEP1_STROBE/GPIO1_23) ; also sheet 5
USR2: IC1.V16(_A:V16_GPMC_A8/GMII2_RXD3/RGMII2_RD3/MMC2_DAT6/GPMC_A24/PR1_MII1_RXD0/MCASP0_ACLKX/GPIO1_24) ; also sheet 5
USR3: IC1.U16(_A:U16_GPMC_A9/GMII2_RXD2/RGMII2_RD2/MMC2_DAT7/GPMC_A25/PR1_MII_MR1_CLK/MCASP0_FSX/GPIO1_25) ; also sheet 5
VDD_3V3A: R276.2 ; supply symbol labelled VCC ; also sheet 1,2,5,10
VDDS_DDR: R226.1 ; supply symbol labelled VCC ; also sheet 1,2,6,12
VRTC: C168.1 U4.1(A:1A) U4.2(A:1B) U4.8(A:VCC) ; supply symbol labelled VCC ; also sheet 1,2,4
VRTC_DET: R280.2 U4.7(A:1Y)
VRTC_DET_OUT: R281.2 U4.3(B:2Y)
VRTC_DETB: C169.1 R280.1 U4.5(B:2A) U4.6(B:2B)
XDMA_EVENT_INTR0: IC1.A15(_A:A15_EVENT_INTR0/TIMER4/CLKOUT1/SPI1_CS1/PR1PRU1R31_16/EMU2/GPIO0_19) ; also sheet 9
Unconnected: IC1.D3(_A:D3_DDR_A15) IC1.H4(_A:H4_DDR_A14) IC1.R13(_A:R13_GPMC_A0/GMII2_TXEN/RGMII2_TCTL/RMII2_TXEN/GPMC_A16/PR1_MII_MT1_CLK/EHRPWM1_TRIPZONE_INPUT/GPIO1_16) IC1.T13(_A:T13_GPMC_CSN3/MMC2_CMD/PR1_MDIO_DATA/GPIO2_0) IC1.T16(_A:T16_GPMC_A10/GMII2_RXD1/RGMII2_RD1/RMII2_RXD1/GPMC_A26/PR1_MII1_CRS/MCASP0_AXR0/GPIO1_26) IC1.V15(_A:V15_GPMC_A5/GMII2_TXD0/RGMII2_TD0/RMII2_TXD0/GPMC_A21/PR1_MII1_RXD3/EQEP1B_IN/GPIO1_21) Y8.2 Y8.4 Y9.2 Y9.4

### Notes on the sheet
- 24MHz, DNI | 24MHz
- TILLE:
- BeagleBone Processor 2 of 3
- Document Number: | REV:
- Date: | Sheet: 3/13

## Sheet 4 of 13
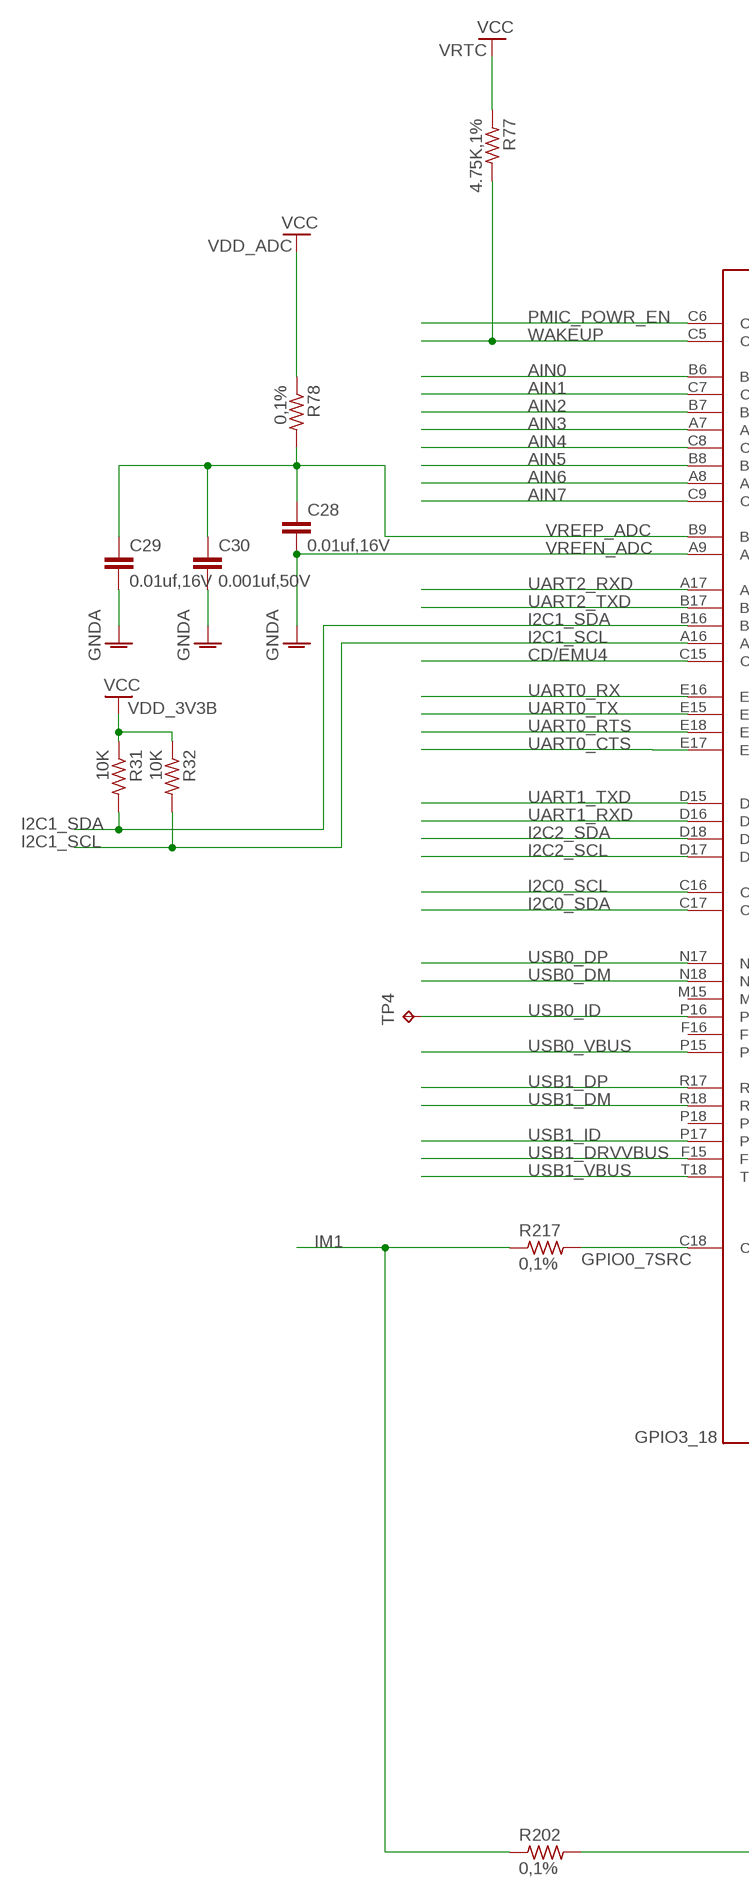
[diagram p4: schematic, sheet 4, part 1 of 2]
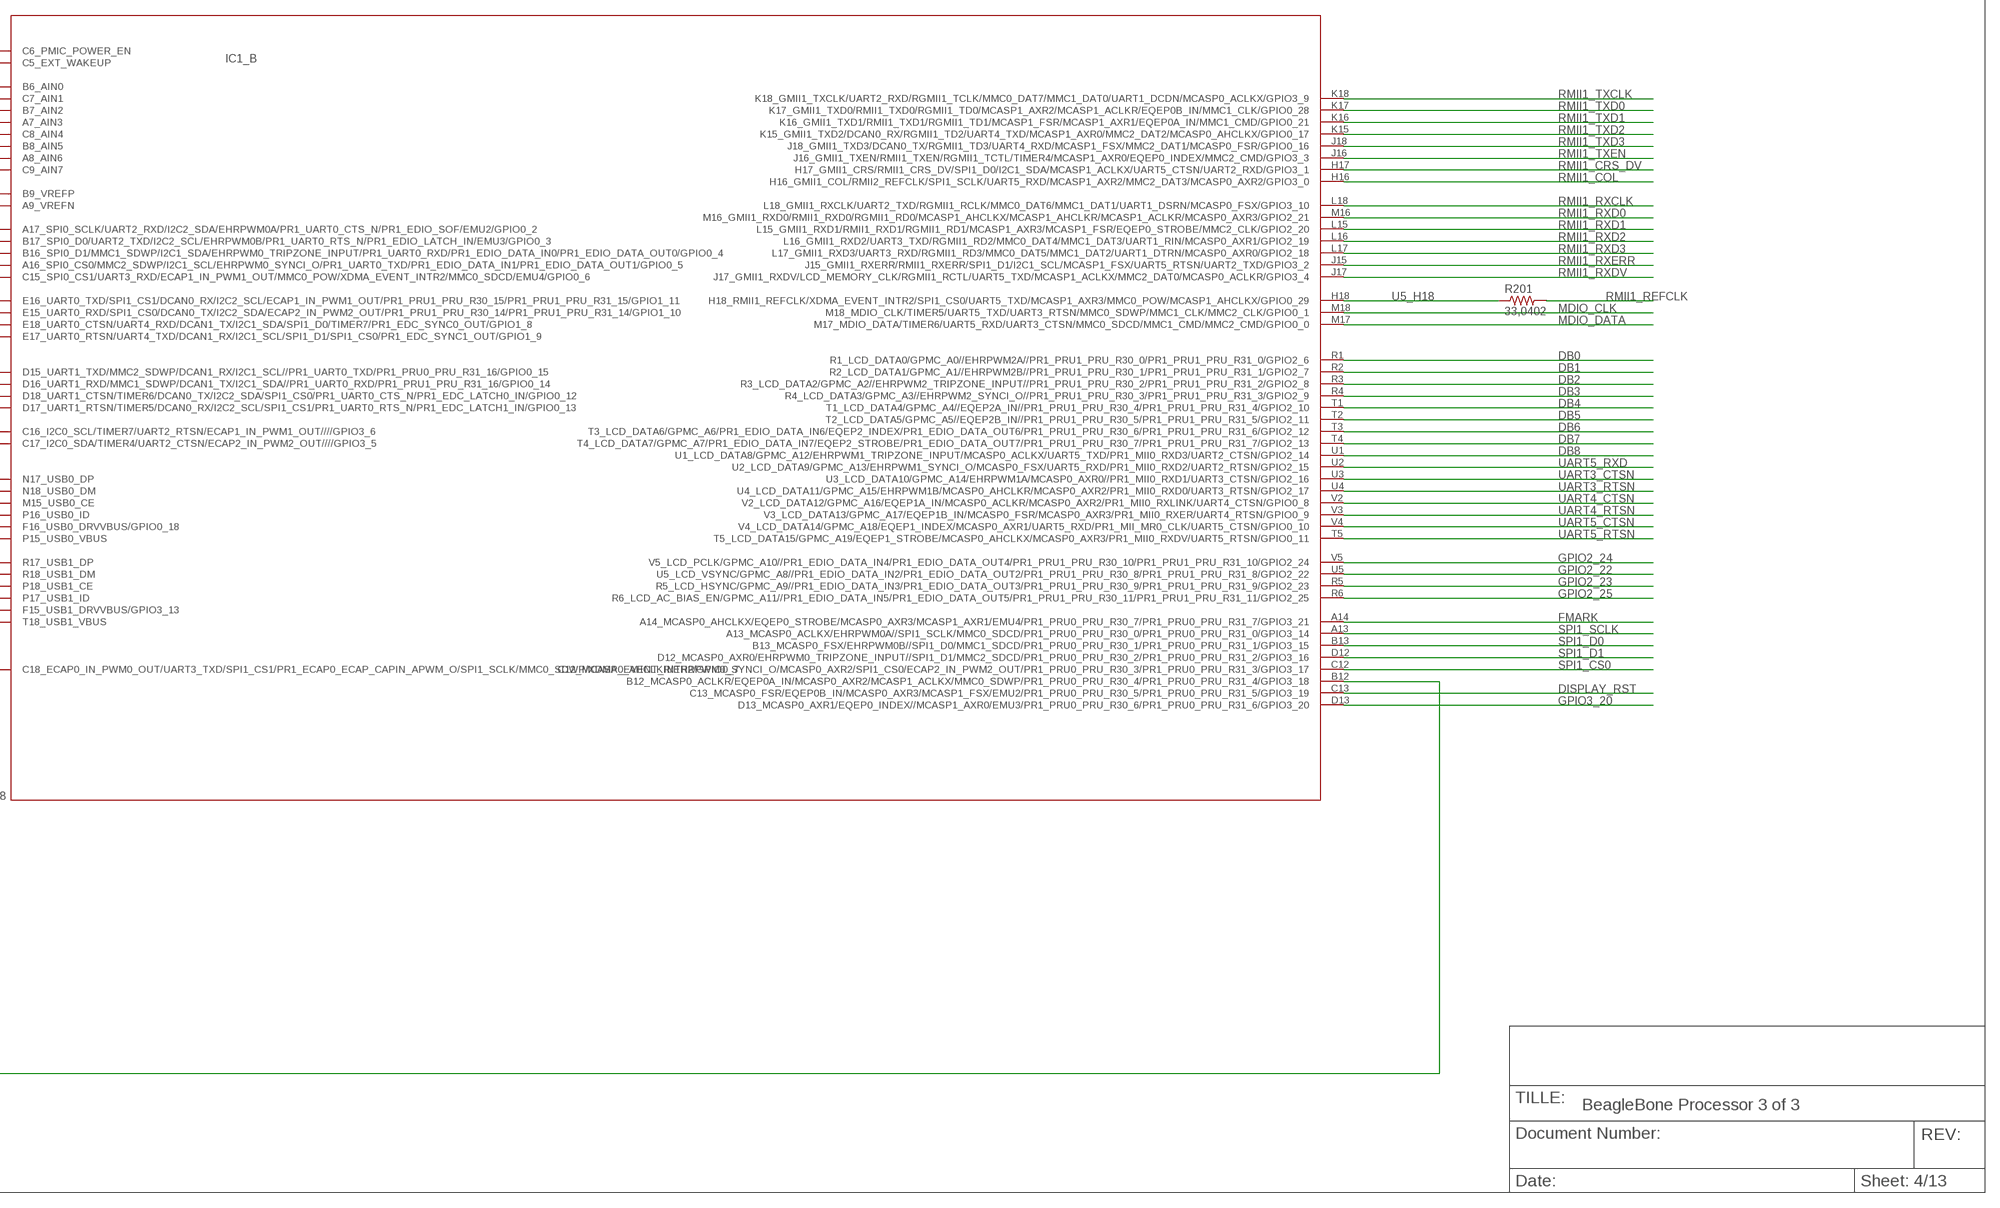
[diagram p5: schematic, sheet 4, part 2 of 2]

### Parts
C28  0.01uf,16V  C-EUC0402  [C0402]
C29  0.01uf,16V  C-EUC0402  [C0402]
C30  0.001uf,50V  C-EUC0402  [C0402]
R31  10K  R-US_R0402  [R0402]
R32  10K  R-US_R0402  [R0402]
R77  4.75K,1%  R-US_R0402  [R0402]
R78  0,1%  R-US_R0402  [R0402]
R201  33,0402  R-US_R0402  [R0402]
R202  0,1%  R-US_R0402  [R0402]
R217  0,1%  R-US_R0402  [R0402]
TP4  TPB1,27  [B1,27]

### Nets
AIN0: IC1.B6(_B:B6_AIN0) ; also sheet 10
AIN1: IC1.C7(_B:C7_AIN1) ; also sheet 10
AIN2: IC1.B7(_B:B7_AIN2) ; also sheet 10
AIN3: IC1.A7(_B:A7_AIN3) ; also sheet 10
AIN4: IC1.C8(_B:C8_AIN4) ; also sheet 10
AIN5: IC1.B8(_B:B8_AIN5) ; also sheet 10
AIN6: IC1.A8(_B:A8_AIN6) ; also sheet 10
AIN7: IC1.C9(_B:C9_AIN7) ; also sheet 1
CD/EMU4: IC1.C15(_B:C15_SPI0_CS1/UART3_RXD/ECAP1_IN_PWM1_OUT/MMC0_POW/XDMA_EVENT_INTR2/MMC0_SDCD/EMU4/GPIO0_6) ; also sheet 9,10
DB0: IC1.R1(_B:R1_LCD_DATA0/GPMC_A0//EHRPWM2A//PR1_PRU1_PRU_R30_0/PR1_PRU1_PRU_R31_0/GPIO2_6) ; also sheet 10,13
DB1: IC1.R2(_B:R2_LCD_DATA1/GPMC_A1//EHRPWM2B//PR1_PRU1_PRU_R30_1/PR1_PRU1_PRU_R31_1/GPIO2_7) ; also sheet 10,13
DB2: IC1.R3(_B:R3_LCD_DATA2/GPMC_A2//EHRPWM2_TRIPZONE_INPUT//PR1_PRU1_PRU_R30_2/PR1_PRU1_PRU_R31_2/GPIO2_8) ; also sheet 10,13
DB3: IC1.R4(_B:R4_LCD_DATA3/GPMC_A3//EHRPWM2_SYNCI_O//PR1_PRU1_PRU_R30_3/PR1_PRU1_PRU_R31_3/GPIO2_9) ; also sheet 10,13
DB4: IC1.T1(_B:T1_LCD_DATA4/GPMC_A4//EQEP2A_IN//PR1_PRU1_PRU_R30_4/PR1_PRU1_PRU_R31_4/GPIO2_10) ; also sheet 10,13
DB5: IC1.T2(_B:T2_LCD_DATA5/GPMC_A5//EQEP2B_IN//PR1_PRU1_PRU_R30_5/PR1_PRU1_PRU_R31_5/GPIO2_11) ; also sheet 10,13
DB6: IC1.T3(_B:T3_LCD_DATA6/GPMC_A6/PR1_EDIO_DATA_IN6/EQEP2_INDEX/PR1_EDIO_DATA_OUT6/PR1_PRU1_PRU_R30_6/PR1_PRU1_PRU_R31_6/GPIO2_12) ; also sheet 10,13
DB7: IC1.T4(_B:T4_LCD_DATA7/GPMC_A7/PR1_EDIO_DATA_IN7/EQEP2_STROBE/PR1_EDIO_DATA_OUT7/PR1_PRU1_PRU_R30_7/PR1_PRU1_PRU_R31_7/GPIO2_13) ; also sheet 10,13
DB8: IC1.U1(_B:U1_LCD_DATA8/GPMC_A12/EHRPWM1_TRIPZONE_INPUT/MCASP0_ACLKX/UART5_TXD/PR1_MII0_RXD3/UART2_CTSN/GPIO2_14) ; also sheet 10,13
DISPLAY_RST: IC1.C13(_B:C13_MCASP0_FSR/EQEP0B_IN/MCASP0_AXR3/MCASP1_FSX/EMU2/PR1_PRU0_PRU_R30_5/PR1_PRU0_PRU_R31_5/GPIO3_19) ; also sheet 10,13
FMARK: IC1.A14(_B:A14_MCASP0_AHCLKX/EQEP0_STROBE/MCASP0_AXR3/MCASP1_AXR1/EMU4/PR1_PRU0_PRU_R30_7/PR1_PRU0_PRU_R31_7/GPIO3_21) ; also sheet 10,13
GNDA: C29.2 C30.2 ; also sheet 2,5
GPIO0_7SRC: IC1.C18(_B:C18_ECAP0_IN_PWM0_OUT/UART3_TXD/SPI1_CS1/PR1_ECAP0_ECAP_CAPIN_APWM_O/SPI1_SCLK/MMC0_SDWP/XDMA_EVENT_INTR2/GPIO0_7) R217.2
GPIO2_22: IC1.U5(_B:U5_LCD_VSYNC/GPMC_A8//PR1_EDIO_DATA_IN2/PR1_EDIO_DATA_OUT2/PR1_PRU1_PRU_R30_8/PR1_PRU1_PRU_R31_8/GPIO2_22) ; also sheet 10
GPIO2_23: IC1.R5(_B:R5_LCD_HSYNC/GPMC_A9//PR1_EDIO_DATA_IN3/PR1_EDIO_DATA_OUT3/PR1_PRU1_PRU_R30_9/PR1_PRU1_PRU_R31_9/GPIO2_23) ; also sheet 10
GPIO2_24: IC1.V5(_B:V5_LCD_PCLK/GPMC_A10//PR1_EDIO_DATA_IN4/PR1_EDIO_DATA_OUT4/PR1_PRU1_PRU_R30_10/PR1_PRU1_PRU_R31_10/GPIO2_24) ; also sheet 10
GPIO2_25: IC1.R6(_B:R6_LCD_AC_BIAS_EN/GPMC_A11//PR1_EDIO_DATA_IN5/PR1_EDIO_DATA_OUT5/PR1_PRU1_PRU_R30_11/PR1_PRU1_PRU_R31_11/GPIO2_25) ; also sheet 10
GPIO3_18: IC1.B12(_B:B12_MCASP0_ACLKR/EQEP0A_IN/MCASP0_AXR2/MCASP1_ACLKX/MMC0_SDWP/PR1_PRU0_PRU_R30_4/PR1_PRU0_PRU_R31_4/GPIO3_18) R202.2
GPIO3_20: IC1.D13(_B:D13_MCASP0_AXR1/EQEP0_INDEX//MCASP1_AXR0/EMU3/PR1_PRU0_PRU_R30_6/PR1_PRU0_PRU_R31_6/GPIO3_20) ; also sheet 3
I2C0_SCL: IC1.C16(_B:C16_I2C0_SCL/TIMER7/UART2_RTSN/ECAP1_IN_PWM1_OUT////GPIO3_6) ; also sheet 1,6,11
I2C0_SDA: IC1.C17(_B:C17_I2C0_SDA/TIMER4/UART2_CTSN/ECAP2_IN_PWM2_OUT////GPIO3_5) ; also sheet 1,6,11
I2C1_SCL: IC1.A16(_B:A16_SPI0_CS0/MMC2_SDWP/I2C1_SCL/EHRPWM0_SYNCI_O/PR1_UART0_TXD/PR1_EDIO_DATA_IN1/PR1_EDIO_DATA_OUT1/GPIO0_5) R32.2 ; also sheet 10,13
I2C1_SDA: IC1.B16(_B:B16_SPI0_D1/MMC1_SDWP/I2C1_SDA/EHRPWM0_TRIPZONE_INPUT/PR1_UART0_RXD/PR1_EDIO_DATA_IN0/PR1_EDIO_DATA_OUT0/GPIO0_4) R31.2 ; also sheet 10,13
I2C2_SCL: IC1.D17(_B:D17_UART1_RTSN/TIMER5/DCAN0_RX/I2C2_SCL/SPI1_CS1/PR1_UART0_RTS_N/PR1_EDC_LATCH1_IN/GPIO0_13) ; also sheet 10
I2C2_SDA: IC1.D18(_B:D18_UART1_CTSN/TIMER6/DCAN0_TX/I2C2_SDA/SPI1_CS0/PR1_UART0_CTS_N/PR1_EDC_LATCH0_IN/GPIO0_12) ; also sheet 10
IM1: R202.1 R217.1 ; also sheet 10,13
MDIO_CLK: IC1.M18(_B:M18_MDIO_CLK/TIMER5/UART5_TXD/UART3_RTSN/MMC0_SDWP/MMC1_CLK/MMC2_CLK/GPIO0_1) ; also sheet 7
MDIO_DATA: IC1.M17(_B:M17_MDIO_DATA/TIMER6/UART5_RXD/UART3_CTSN/MMC0_SDCD/MMC1_CMD/MMC2_CMD/GPIO0_0) ; also sheet 7
PMIC_POWR_EN: IC1.C6(_B:C6_PMIC_POWER_EN) ; also sheet 1
RMII1_COL: IC1.H16(_B:H16_GMII1_COL/RMII2_REFCLK/SPI1_SCLK/UART5_RXD/MCASP1_AXR2/MMC2_DAT3/MCASP0_AXR2/GPIO3_0) ; also sheet 7
RMII1_CRS_DV: IC1.H17(_B:H17_GMII1_CRS/RMII1_CRS_DV/SPI1_D0/I2C1_SDA/MCASP1_ACLKX/UART5_CTSN/UART2_RXD/GPIO3_1) ; also sheet 7
RMII1_REFCLK: R201.2 ; also sheet 7
RMII1_RXCLK: IC1.L18(_B:L18_GMII1_RXCLK/UART2_TXD/RGMII1_RCLK/MMC0_DAT6/MMC1_DAT1/UART1_DSRN/MCASP0_FSX/GPIO3_10) ; also sheet 7
RMII1_RXD0: IC1.M16(_B:M16_GMII1_RXD0/RMII1_RXD0/RGMII1_RD0/MCASP1_AHCLKX/MCASP1_AHCLKR/MCASP1_ACLKR/MCASP0_AXR3/GPIO2_21) ; also sheet 7
RMII1_RXD1: IC1.L15(_B:L15_GMII1_RXD1/RMII1_RXD1/RGMII1_RD1/MCASP1_AXR3/MCASP1_FSR/EQEP0_STROBE/MMC2_CLK/GPIO2_20) ; also sheet 7
RMII1_RXD2: IC1.L16(_B:L16_GMII1_RXD2/UART3_TXD/RGMII1_RD2/MMC0_DAT4/MMC1_DAT3/UART1_RIN/MCASP0_AXR1/GPIO2_19) ; also sheet 7
RMII1_RXD3: IC1.L17(_B:L17_GMII1_RXD3/UART3_RXD/RGMII1_RD3/MMC0_DAT5/MMC1_DAT2/UART1_DTRN/MCASP0_AXR0/GPIO2_18) ; also sheet 7
RMII1_RXDV: IC1.J17(_B:J17_GMII1_RXDV/LCD_MEMORY_CLK/RGMII1_RCTL/UART5_TXD/MCASP1_ACLKX/MMC2_DAT0/MCASP0_ACLKR/GPIO3_4) ; also sheet 7
RMII1_RXERR: IC1.J15(_B:J15_GMII1_RXERR/RMII1_RXERR/SPI1_D1/I2C1_SCL/MCASP1_FSX/UART5_RTSN/UART2_TXD/GPIO3_2) ; also sheet 7
RMII1_TXCLK: IC1.K18(_B:K18_GMII1_TXCLK/UART2_RXD/RGMII1_TCLK/MMC0_DAT7/MMC1_DAT0/UART1_DCDN/MCASP0_ACLKX/GPIO3_9) ; also sheet 7
RMII1_TXD0: IC1.K17(_B:K17_GMII1_TXD0/RMII1_TXD0/RGMII1_TD0/MCASP1_AXR2/MCASP1_ACLKR/EQEP0B_IN/MMC1_CLK/GPIO0_28) ; also sheet 7
RMII1_TXD1: IC1.K16(_B:K16_GMII1_TXD1/RMII1_TXD1/RGMII1_TD1/MCASP1_FSR/MCASP1_AXR1/EQEP0A_IN/MMC1_CMD/GPIO0_21) ; also sheet 7
RMII1_TXD2: IC1.K15(_B:K15_GMII1_TXD2/DCAN0_RX/RGMII1_TD2/UART4_TXD/MCASP1_AXR0/MMC2_DAT2/MCASP0_AHCLKX/GPIO0_17) ; also sheet 7
RMII1_TXD3: IC1.J18(_B:J18_GMII1_TXD3/DCAN0_TX/RGMII1_TD3/UART4_RXD/MCASP1_FSX/MMC2_DAT1/MCASP0_FSR/GPIO0_16) ; also sheet 7
RMII1_TXEN: IC1.J16(_B:J16_GMII1_TXEN/RMII1_TXEN/RGMII1_TCTL/TIMER4/MCASP1_AXR0/EQEP0_INDEX/MMC2_CMD/GPIO3_3) ; also sheet 7
SPI1_CS0: IC1.C12(_B:C12_MCASP0_AHCLKR/EHRPWM0_SYNCI_O/MCASP0_AXR2/SPI1_CS0/ECAP2_IN_PWM2_OUT/PR1_PRU0_PRU_R30_3/PR1_PRU0_PRU_R31_3/GPIO3_17) ; also sheet 10,11,13
SPI1_D0: IC1.B13(_B:B13_MCASP0_FSX/EHRPWM0B//SPI1_D0/MMC1_SDCD/PR1_PRU0_PRU_R30_1/PR1_PRU0_PRU_R31_1/GPIO3_15) ; also sheet 10,11,13
SPI1_D1: IC1.D12(_B:D12_MCASP0_AXR0/EHRPWM0_TRIPZONE_INPUT//SPI1_D1/MMC2_SDCD/PR1_PRU0_PRU_R30_2/PR1_PRU0_PRU_R31_2/GPIO3_16) ; also sheet 10,13
SPI1_SCLK: IC1.A13(_B:A13_MCASP0_ACLKX/EHRPWM0A//SPI1_SCLK/MMC0_SDCD/PR1_PRU0_PRU_R30_0/PR1_PRU0_PRU_R31_0/GPIO3_14) ; also sheet 10,11,13
U5_H18: IC1.H18(_B:H18_RMII1_REFCLK/XDMA_EVENT_INTR2/SPI1_CS0/UART5_TXD/MCASP1_AXR3/MMC0_POW/MCASP1_AHCLKX/GPIO0_29) R201.1
UART0_CTS: IC1.E17(_B:E17_UART0_RTSN/UART4_TXD/DCAN1_RX/I2C1_SCL/SPI1_D1/SPI1_CS0/PR1_EDC_SYNC1_OUT/GPIO1_9) ; also sheet 9
UART0_RTS: IC1.E18(_B:E18_UART0_CTSN/UART4_RXD/DCAN1_TX/I2C1_SDA/SPI1_D0/TIMER7/PR1_EDC_SYNC0_OUT/GPIO1_8) ; also sheet 9
UART0_RX: IC1.E16(_B:E16_UART0_TXD/SPI1_CS1/DCAN0_RX/I2C2_SCL/ECAP1_IN_PWM1_OUT/PR1_PRU1_PRU_R30_15/PR1_PRU1_PRU_R31_15/GPIO1_11) ; also sheet 9
UART0_TX: IC1.E15(_B:E15_UART0_RXD/SPI1_CS0/DCAN0_TX/I2C2_SDA/ECAP2_IN_PWM2_OUT/PR1_PRU1_PRU_R30_14/PR1_PRU1_PRU_R31_14/GPIO1_10) ; also sheet 9
UART1_RXD: IC1.D16(_B:D16_UART1_RXD/MMC1_SDWP/DCAN1_TX/I2C1_SDA//PR1_UART0_RXD/PR1_PRU1_PRU_R31_16/GPIO0_14) ; also sheet 10
UART1_TXD: IC1.D15(_B:D15_UART1_TXD/MMC2_SDWP/DCAN1_RX/I2C1_SCL//PR1_UART0_TXD/PR1_PRU0_PRU_R31_16/GPIO0_15) ; also sheet 10
UART2_RXD: IC1.A17(_B:A17_SPI0_SCLK/UART2_RXD/I2C2_SDA/EHRPWM0A/PR1_UART0_CTS_N/PR1_EDIO_SOF/EMU2/GPIO0_2) ; also sheet 10
UART2_TXD: IC1.B17(_B:B17_SPI0_D0/UART2_TXD/I2C2_SCL/EHRPWM0B/PR1_UART0_RTS_N/PR1_EDIO_LATCH_IN/EMU3/GPIO0_3) ; also sheet 10
UART3_CTSN: IC1.U3(_B:U3_LCD_DATA10/GPMC_A14/EHRPWM1A/MCASP0_AXR0//PR1_MII0_RXD1/UART3_CTSN/GPIO2_16) ; also sheet 10
UART3_RTSN: IC1.U4(_B:U4_LCD_DATA11/GPMC_A15/EHRPWM1B/MCASP0_AHCLKR/MCASP0_AXR2/PR1_MII0_RXD0/UART3_RTSN/GPIO2_17) ; also sheet 10
UART4_CTSN: IC1.V2(_B:V2_LCD_DATA12/GPMC_A16/EQEP1A_IN/MCASP0_ACLKR/MCASP0_AXR2/PR1_MII0_RXLINK/UART4_CTSN/GPIO0_8) ; also sheet 10
UART4_RTSN: IC1.V3(_B:V3_LCD_DATA13/GPMC_A17/EQEP1B_IN/MCASP0_FSR/MCASP0_AXR3/PR1_MII0_RXER/UART4_RTSN/GPIO0_9) ; also sheet 10
UART5_CTSN: IC1.V4(_B:V4_LCD_DATA14/GPMC_A18/EQEP1_INDEX/MCASP0_AXR1/UART5_RXD/PR1_MII_MR0_CLK/UART5_CTSN/GPIO0_10) ; also sheet 10
UART5_RTSN: IC1.T5(_B:T5_LCD_DATA15/GPMC_A19/EQEP1_STROBE/MCASP0_AHCLKX/MCASP0_AXR3/PR1_MII0_RXDV/UART5_RTSN/GPIO0_11) ; also sheet 10
UART5_RXD: IC1.U2(_B:U2_LCD_DATA9/GPMC_A13/EHRPWM1_SYNCI_O/MCASP0_FSX/UART5_RXD/PR1_MII0_RXD2/UART2_RTSN/GPIO2_15) ; also sheet 10
USB0_DM: IC1.N18(_B:N18_USB0_DM) ; also sheet 8
USB0_DP: IC1.N17(_B:N17_USB0_DP) ; also sheet 8
USB0_ID: IC1.P16(_B:P16_USB0_ID) TP4.TP
USB0_VBUS: IC1.P15(_B:P15_USB0_VBUS) ; also sheet 8
USB1_DM: IC1.R18(_B:R18_USB1_DM) ; also sheet 7
USB1_DP: IC1.R17(_B:R17_USB1_DP) ; also sheet 7
USB1_DRVVBUS: IC1.F15(_B:F15_USB1_DRVVBUS/GPIO3_13) ; also sheet 7
USB1_ID: IC1.P17(_B:P17_USB1_ID) ; also sheet 7
USB1_VBUS: IC1.T18(_B:T18_USB1_VBUS) ; also sheet 7
VDD_3V3B: R31.1 R32.1 ; supply symbol labelled VCC ; also sheet 1,6,7,8,9,10,11,13
VDD_ADC: R78.1 ; supply symbol labelled VCC ; also sheet 2,10
VREFN_ADC: C28.2 IC1.A9(_B:A9_VREFN) ; supply symbol labelled GNDA
VREFP_ADC: C28.1 C29.1 C30.1 IC1.B9(_B:B9_VREFP) R78.2
VRTC: R77.1 ; supply symbol labelled VCC ; also sheet 1,2,3
WAKEUP: IC1.C5(_B:C5_EXT_WAKEUP) R77.2 ; also sheet 1
Unconnected: IC1.F16(_B:F16_USB0_DRVVBUS/GPIO0_18) IC1.M15(_B:M15_USB0_CE) IC1.P18(_B:P18_USB1_CE)

### Notes on the sheet
- TILLE:
- BeagleBone Processor 3 of 3
- Document Number: | REV:
- Date: | Sheet: 4/13

## Sheet 5 of 13
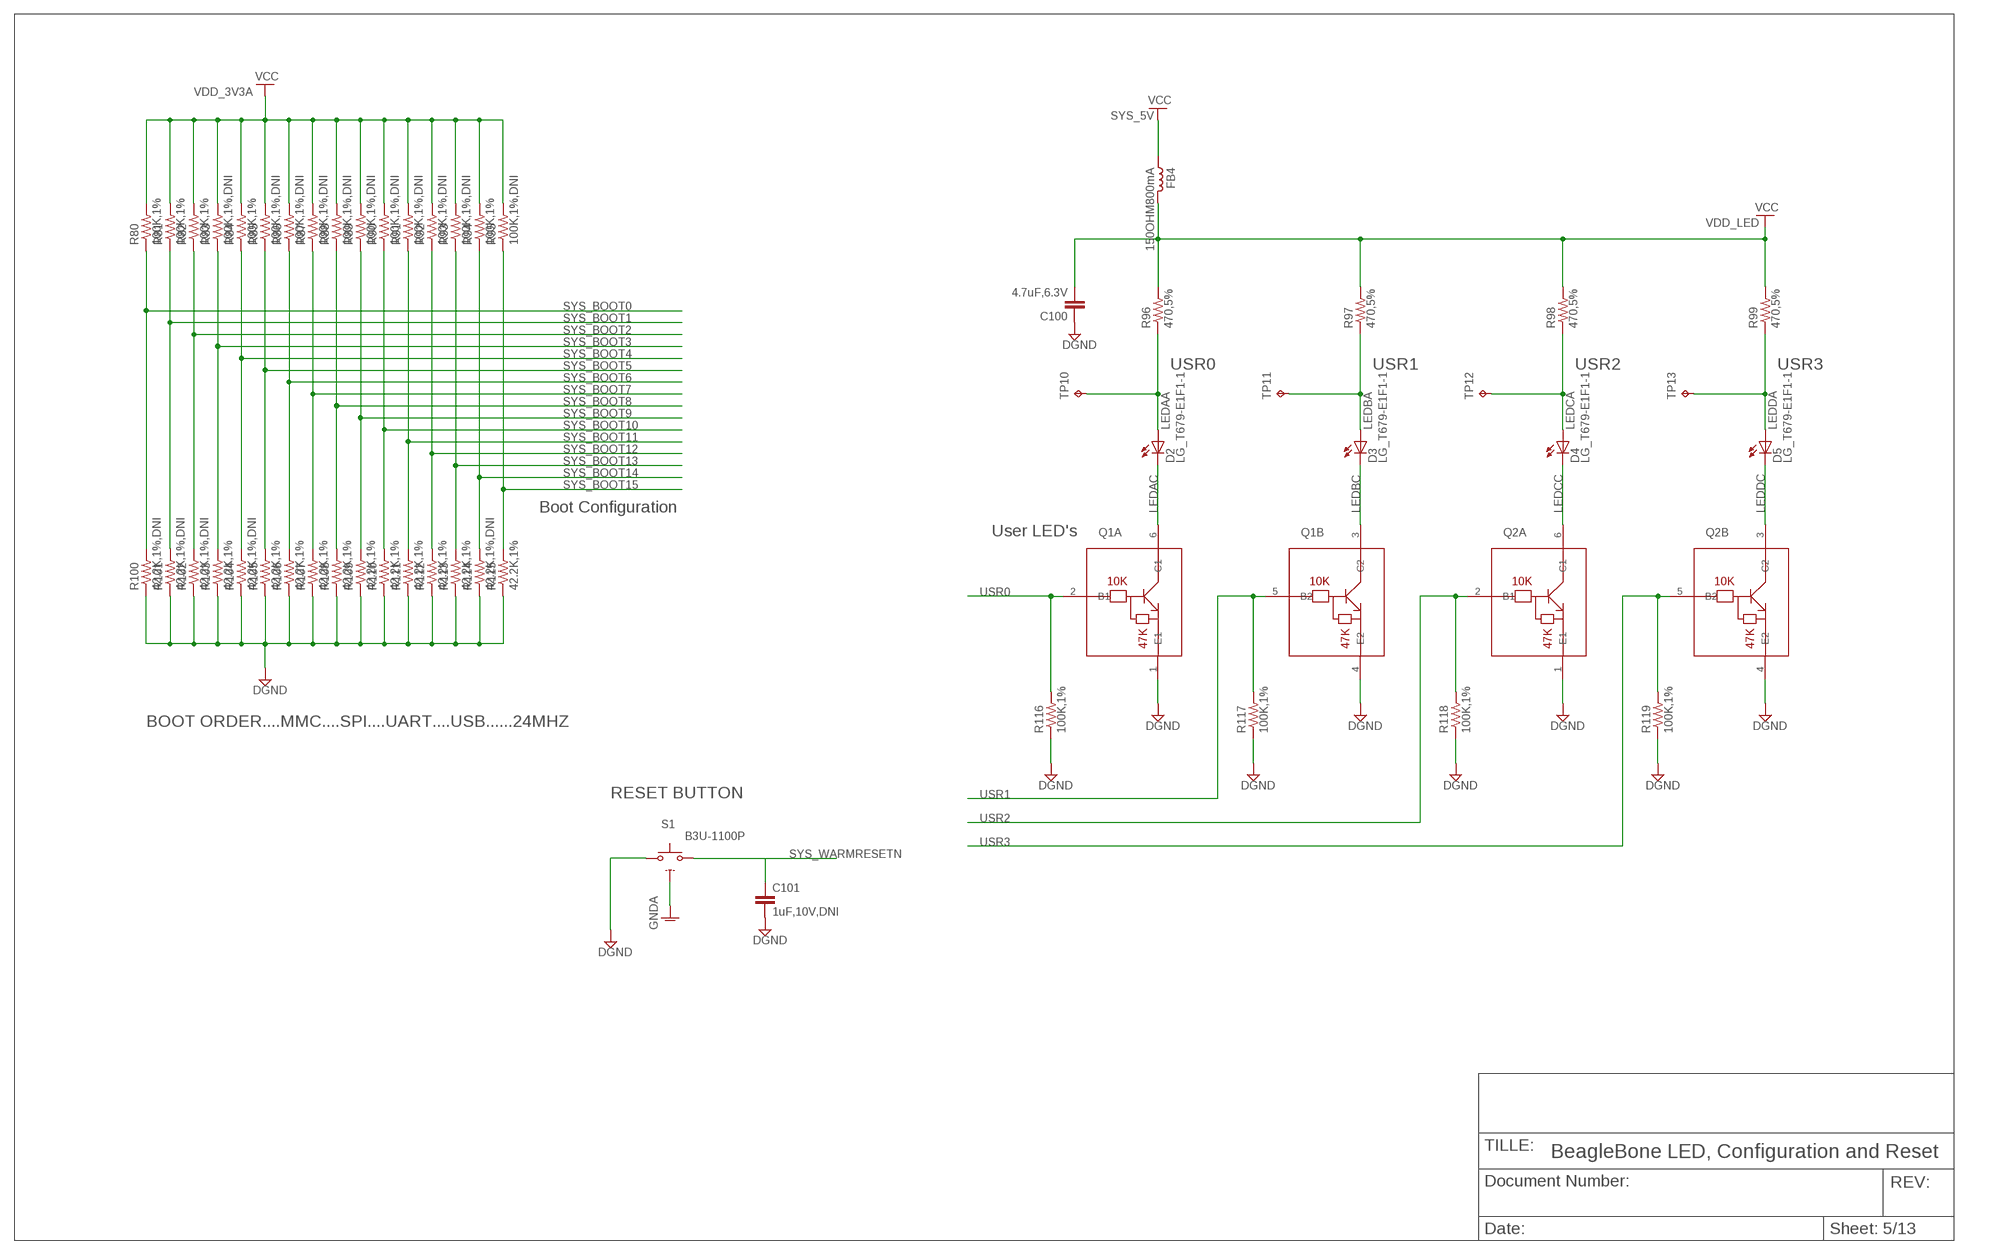
[diagram p6: schematic, sheet 5]

### Parts
C100  4.7uF,6.3V  C-EUC0402  [C0402]
C101  1uF,10V,DNI  C-EUC0805  [C0805]
D2  LG_T679-E1F1-1  [PLCC2]
D3  LG_T679-E1F1-1  [PLCC2]
D4  LG_T679-E1F1-1  [PLCC2]
D5  LG_T679-E1F1-1  [PLCC2]
FB4  150OHM800mA  L-USL0603  [L0603]
Q1  DMC56404  [DMC56404]
Q2  DMC56404  [DMC56404]
R80  100K,1%  R-US_R0402  [R0402]
R81  100K,1%  R-US_R0402  [R0402]
R82  100K,1%  R-US_R0402  [R0402]
R83  100K,1%,DNI  R-US_R0402  [R0402]
R84  100K,1%  R-US_R0402  [R0402]
R85  100K,1%,DNI  R-US_R0402  [R0402]
R86  100K,1%,DNI  R-US_R0402  [R0402]
R87  100K,1%,DNI  R-US_R0402  [R0402]
R88  100K,1%,DNI  R-US_R0402  [R0402]
R89  100K,1%,DNI  R-US_R0402  [R0402]
R90  100K,1%,DNI  R-US_R0402  [R0402]
R91  100K,1%,DNI  R-US_R0402  [R0402]
R92  100K,1%,DNI  R-US_R0402  [R0402]
R93  100K,1%,DNI  R-US_R0402  [R0402]
R94  100K,1%  R-US_R0402  [R0402]
R95  100K,1%,DNI  R-US_R0402  [R0402]
R96  470,5%  R-US_R0402  [R0402]
R97  470,5%  R-US_R0402  [R0402]
R98  470,5%  R-US_R0402  [R0402]
R99  470,5%  R-US_R0402  [R0402]
R100  42.2K,1%,DNI  R-US_R0402  [R0402]
R101  42.2K,1%,DNI  R-US_R0402  [R0402]
R102  42.2K,1%,DNI  R-US_R0402  [R0402]
R103  42.2K,1%  R-US_R0402  [R0402]
R104  42.2K,1%,DNI  R-US_R0402  [R0402]
R105  42.2K,1%  R-US_R0402  [R0402]
R106  42.2K,1%  R-US_R0402  [R0402]
R107  42.2K,1%  R-US_R0402  [R0402]
R108  42.2K,1%  R-US_R0402  [R0402]
R109  42.2K,1%  R-US_R0402  [R0402]
R110  42.2K,1%  R-US_R0402  [R0402]
R111  42.2K,1%  R-US_R0402  [R0402]
R112  42.2K,1%  R-US_R0402  [R0402]
R113  42.2K,1%  R-US_R0402  [R0402]
R114  42.2K,1%,DNI  R-US_R0402  [R0402]
R115  42.2K,1%  R-US_R0402  [R0402]
R116  100K,1%  R-US_R0402  [R0402]
R117  100K,1%  R-US_R0402  [R0402]
R118  100K,1%  R-US_R0402  [R0402]
R119  100K,1%  R-US_R0402  [R0402]
S1  B3U-1100P  [B3U-1100P]
TP10  TPB1,27  [B1,27]
TP11  TPB1,27  [B1,27]
TP12  TPB1,27  [B1,27]
TP13  TPB1,27  [B1,27]

### Nets
DGND: C100.1 C101.2 Q1.1(A:E1) Q1.4(B:E2) Q2.1(A:E1) Q2.4(B:E2) R100.1 R101.1 R102.1 R103.1 R104.1 R105.1 R106.1 R107.1 R108.1 R109.1 R110.1 R111.1 R112.1 R113.1 R114.1 R115.1 R116.1 R117.1 R118.1 R119.1 S1.1(P) ; also sheet 1,2,3,6,7,8,9,10,11,12,13
GNDA: S1.S(G) ; also sheet 2,4
LEDAA: D2.A R96.1 TP10.TP
LEDAC: D2.C Q1.6(A:C1)
LEDBA: D3.A R97.1 TP11.TP
LEDBC: D3.C Q1.3(B:C2)
LEDCA: D4.A R98.1 TP12.TP
LEDCC: D4.C Q2.6(A:C1)
LEDDA: D5.A R99.1 TP13.TP
LEDDC: D5.C Q2.3(B:C2)
SYS_5V: FB4.2 ; supply symbol labelled VCC ; also sheet 1,7,8,10,11
SYS_BOOT0: R80.1 R100.2
SYS_BOOT1: R81.1 R101.2
SYS_BOOT2: R82.1 R102.2
SYS_BOOT3: R83.1 R103.2
SYS_BOOT4: R84.1 R104.2
SYS_BOOT5: R85.1 R105.2
SYS_BOOT6: R86.1 R106.2
SYS_BOOT7: R87.1 R107.2
SYS_BOOT8: R88.1 R108.2
SYS_BOOT9: R89.1 R109.2
SYS_BOOT10: R90.1 R110.2
SYS_BOOT11: R91.1 R111.2
SYS_BOOT12: R92.1 R112.2
SYS_BOOT13: R93.1 R113.2
SYS_BOOT14: R94.1 R114.2
SYS_BOOT15: R95.1 R115.2
SYS_WARMRESETN: C101.1 S1.2(S) ; also sheet 3,9
USR0: Q1.2(A:B1) R116.2 ; also sheet 3
USR1: Q1.5(B:B2) R117.2 ; also sheet 3
USR2: Q2.2(A:B1) R118.2 ; also sheet 3
USR3: Q2.5(B:B2) R119.2 ; also sheet 3
VDD_3V3A: R80.2 R81.2 R82.2 R83.2 R84.2 R85.2 R86.2 R87.2 R88.2 R89.2 R90.2 R91.2 R92.2 R93.2 R94.2 R95.2 ; supply symbol labelled VCC ; also sheet 1,2,3,10
VDD_LED: C100.2 FB4.1 R96.2 R97.2 R98.2 R99.2 ; supply symbol labelled VCC

### Notes on the sheet
- USR0 | USR1 | USR2 | USR3
- Boot Configuration
- User LED's
- BOOT ORDER....MMC....SPI....UART....USB......24MHZ
- RESET BUTTON
- TILLE:
- BeagleBone LED, Configuration and Reset
- Document Number: | REV:
- Date: | Sheet: 5/13

## Sheet 6 of 13
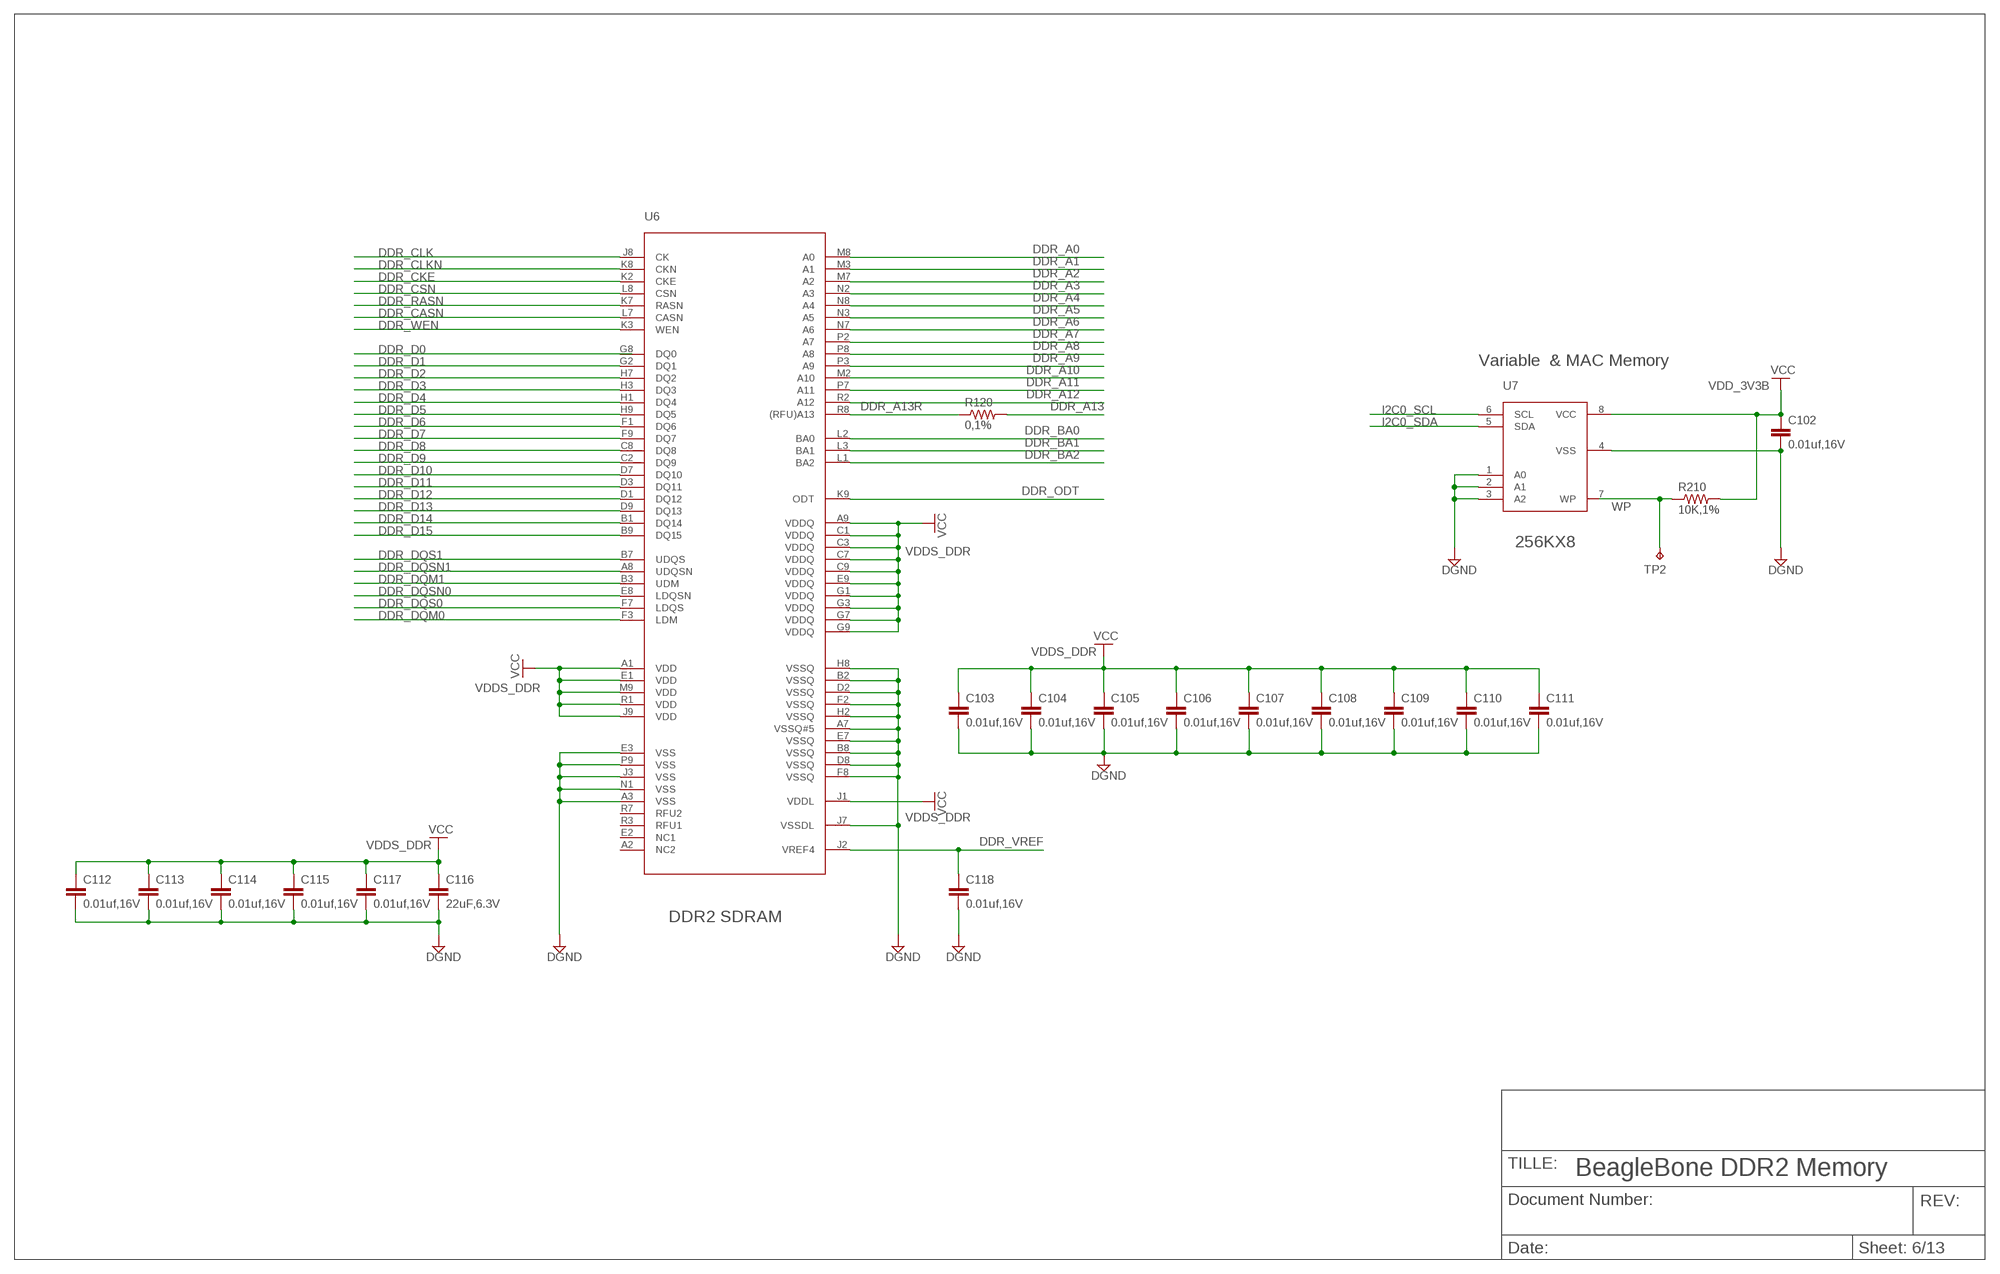
[diagram p7: schematic, sheet 6]

### Parts
C102  0.01uf,16V  C-EUC0402  [C0402]
C103  0.01uf,16V  C-EUC0402  [C0402]
C104  0.01uf,16V  C-EUC0402  [C0402]
C105  0.01uf,16V  C-EUC0402  [C0402]
C106  0.01uf,16V  C-EUC0402  [C0402]
C107  0.01uf,16V  C-EUC0402  [C0402]
C108  0.01uf,16V  C-EUC0402  [C0402]
C109  0.01uf,16V  C-EUC0402  [C0402]
C110  0.01uf,16V  C-EUC0402  [C0402]
C111  0.01uf,16V  C-EUC0402  [C0402]
C112  0.01uf,16V  C-EUC0402  [C0402]
C113  0.01uf,16V  C-EUC0402  [C0402]
C114  0.01uf,16V  C-EUC0402  [C0402]
C115  0.01uf,16V  C-EUC0402  [C0402]
C116  22uF,6.3V  C-EUC0402  [C0402]
C117  0.01uf,16V  C-EUC0402  [C0402]
C118  0.01uf,16V  C-EUC0402  [C0402]
R120  0,1%  R-US_R0402  [R0402]
R210  10K,1%  R-US_R0402  [R0402]
TP2  TPB1,27  [B1,27]
U6  MT47H128M16RT-25E:C  [90FBGA]
U7  CAT24C256W  [SOIC8]

### Nets
DDR_A0: U6.M8(A0) ; also sheet 3,12
DDR_A1: U6.M3(A1) ; also sheet 3,12
DDR_A2: U6.M7(A2) ; also sheet 3,12
DDR_A3: U6.N2(A3) ; also sheet 3,12
DDR_A4: U6.N8(A4) ; also sheet 3,12
DDR_A5: U6.N3(A5) ; also sheet 3,12
DDR_A6: U6.N7(A6) ; also sheet 3,12
DDR_A7: U6.P2(A7) ; also sheet 3,12
DDR_A8: U6.P8(A8) ; also sheet 3,12
DDR_A9: U6.P3(A9) ; also sheet 3,12
DDR_A10: U6.M2(A10) ; also sheet 3,12
DDR_A11: U6.P7(A11) ; also sheet 3,12
DDR_A12: U6.R2(A12) ; also sheet 3,12
DDR_A13: R120.2 ; also sheet 3,12
DDR_A13R: R120.1 U6.R8((RFU)A13)
DDR_BA0: U6.L2(BA0) ; also sheet 3,12
DDR_BA1: U6.L3(BA1) ; also sheet 3,12
DDR_BA2: U6.L1(BA2) ; also sheet 3,12
DDR_CASN: U6.L7(CASN) ; also sheet 3,12
DDR_CKE: U6.K2(CKE) ; also sheet 3,12
DDR_CLK: U6.J8(CK) ; also sheet 3,12
DDR_CLKN: U6.K8(CKN) ; also sheet 3,12
DDR_CSN: U6.L8(CSN) ; also sheet 3,12
DDR_D1: U6.G2(DQ1) ; also sheet 3,12
DDR_D2: U6.H7(DQ2) ; also sheet 3,12
DDR_D3: U6.H3(DQ3) ; also sheet 3,12
DDR_D4: U6.H1(DQ4) ; also sheet 3,12
DDR_D5: U6.H9(DQ5) ; also sheet 3,12
DDR_D6: U6.F1(DQ6) ; also sheet 3,12
DDR_D7: U6.F9(DQ7) ; also sheet 3,12
DDR_D8: U6.C8(DQ8) ; also sheet 3,12
DDR_D9: U6.C2(DQ9) ; also sheet 3,12
DDR_D10: U6.D7(DQ10) ; also sheet 3,12
DDR_D11: U6.D3(DQ11) ; also sheet 3,12
DDR_D12: U6.D1(DQ12) ; also sheet 3,12
DDR_D13: U6.D9(DQ13) ; also sheet 3,12
DDR_D14: U6.B1(DQ14) ; also sheet 3,12
DDR_D15: U6.B9(DQ15) ; also sheet 3,12
DDR_DQM0: U6.F3(LDM) ; also sheet 3,12
DDR_DQM1: U6.B3(UDM) ; also sheet 3,12
DDR_DQS0: U6.F7(LDQS) ; also sheet 3,12
DDR_DQS1: U6.B7(UDQS) ; also sheet 3,12
DDR_DQSN0: U6.E8(LDQSN) ; also sheet 3,12
DDR_DQSN1: U6.A8(UDQSN) ; also sheet 3,12
DDR_ODT: U6.K9(ODT) ; also sheet 3,12
DDR_RASN: U6.K7(RASN) ; also sheet 3,12
DDR_VREF: C118.1 U6.J2(VREF4) ; also sheet 3,12
DDR_WEN: U6.K3(WEN) ; also sheet 3,12
DGND: C102.2 C103.2 C104.2 C105.2 C106.2 C107.2 C108.2 C109.2 C110.2 C111.2 C112.2 C113.2 C114.2 C115.2 C116.2 C117.2 C118.2 U6.A3(VSS) U6.A7(VSSQ#5) U6.B2(VSSQ) U6.B8(VSSQ) U6.D2(VSSQ) U6.D8(VSSQ) U6.E3(VSS) U6.E7(VSSQ) U6.F2(VSSQ) U6.F8(VSSQ) U6.H2(VSSQ) U6.H8(VSSQ) U6.J3(VSS) U6.J7(VSSDL) U6.N1(VSS) U6.P9(VSS) U7.1(A0) U7.2(A1) U7.3(A2) U7.4(VSS) ; also sheet 1,2,3,5,7,8,9,10,11,12,13
I2C0_SCL: U7.6(SCL) ; also sheet 1,4,11
I2C0_SDA: U7.5(SDA) ; also sheet 1,4,11
VDD_3V3B: C102.1 R210.2 U7.8(VCC) ; supply symbol labelled VCC ; also sheet 1,4,7,8,9,10,11,13
VDDS_DDR: C103.1 C104.1 C105.1 C106.1 C107.1 C108.1 C109.1 C110.1 C111.1 C112.1 C113.1 C114.1 C115.1 C116.1 C117.1 U6.A1(VDD) U6.A9(VDDQ) U6.C1(VDDQ) U6.C3(VDDQ) U6.C7(VDDQ) U6.C9(VDDQ) U6.E1(VDD) U6.E9(VDDQ) U6.G1(VDDQ) U6.G3(VDDQ) U6.G7(VDDQ) U6.G9(VDDQ) U6.J1(VDDL) U6.J9(VDD) U6.M9(VDD) U6.R1(VDD) ; supply symbol labelled VCC ; also sheet 1,2,3,12
WP: R210.1 TP2.TP
Unconnected: U6.A2(NC2) U6.E2(NC1) U6.G8(DQ0) U6.R3(RFU1) U6.R7(RFU2) U7.7(WP)

### Notes on the sheet
- Variable  & MAC Memory
- 256KX8
- DDR2 SDRAM
- TILLE:
- BeagleBone DDR2 Memory
- Document Number: | REV:
- Date: | Sheet: 6/13

## Sheet 7 of 13
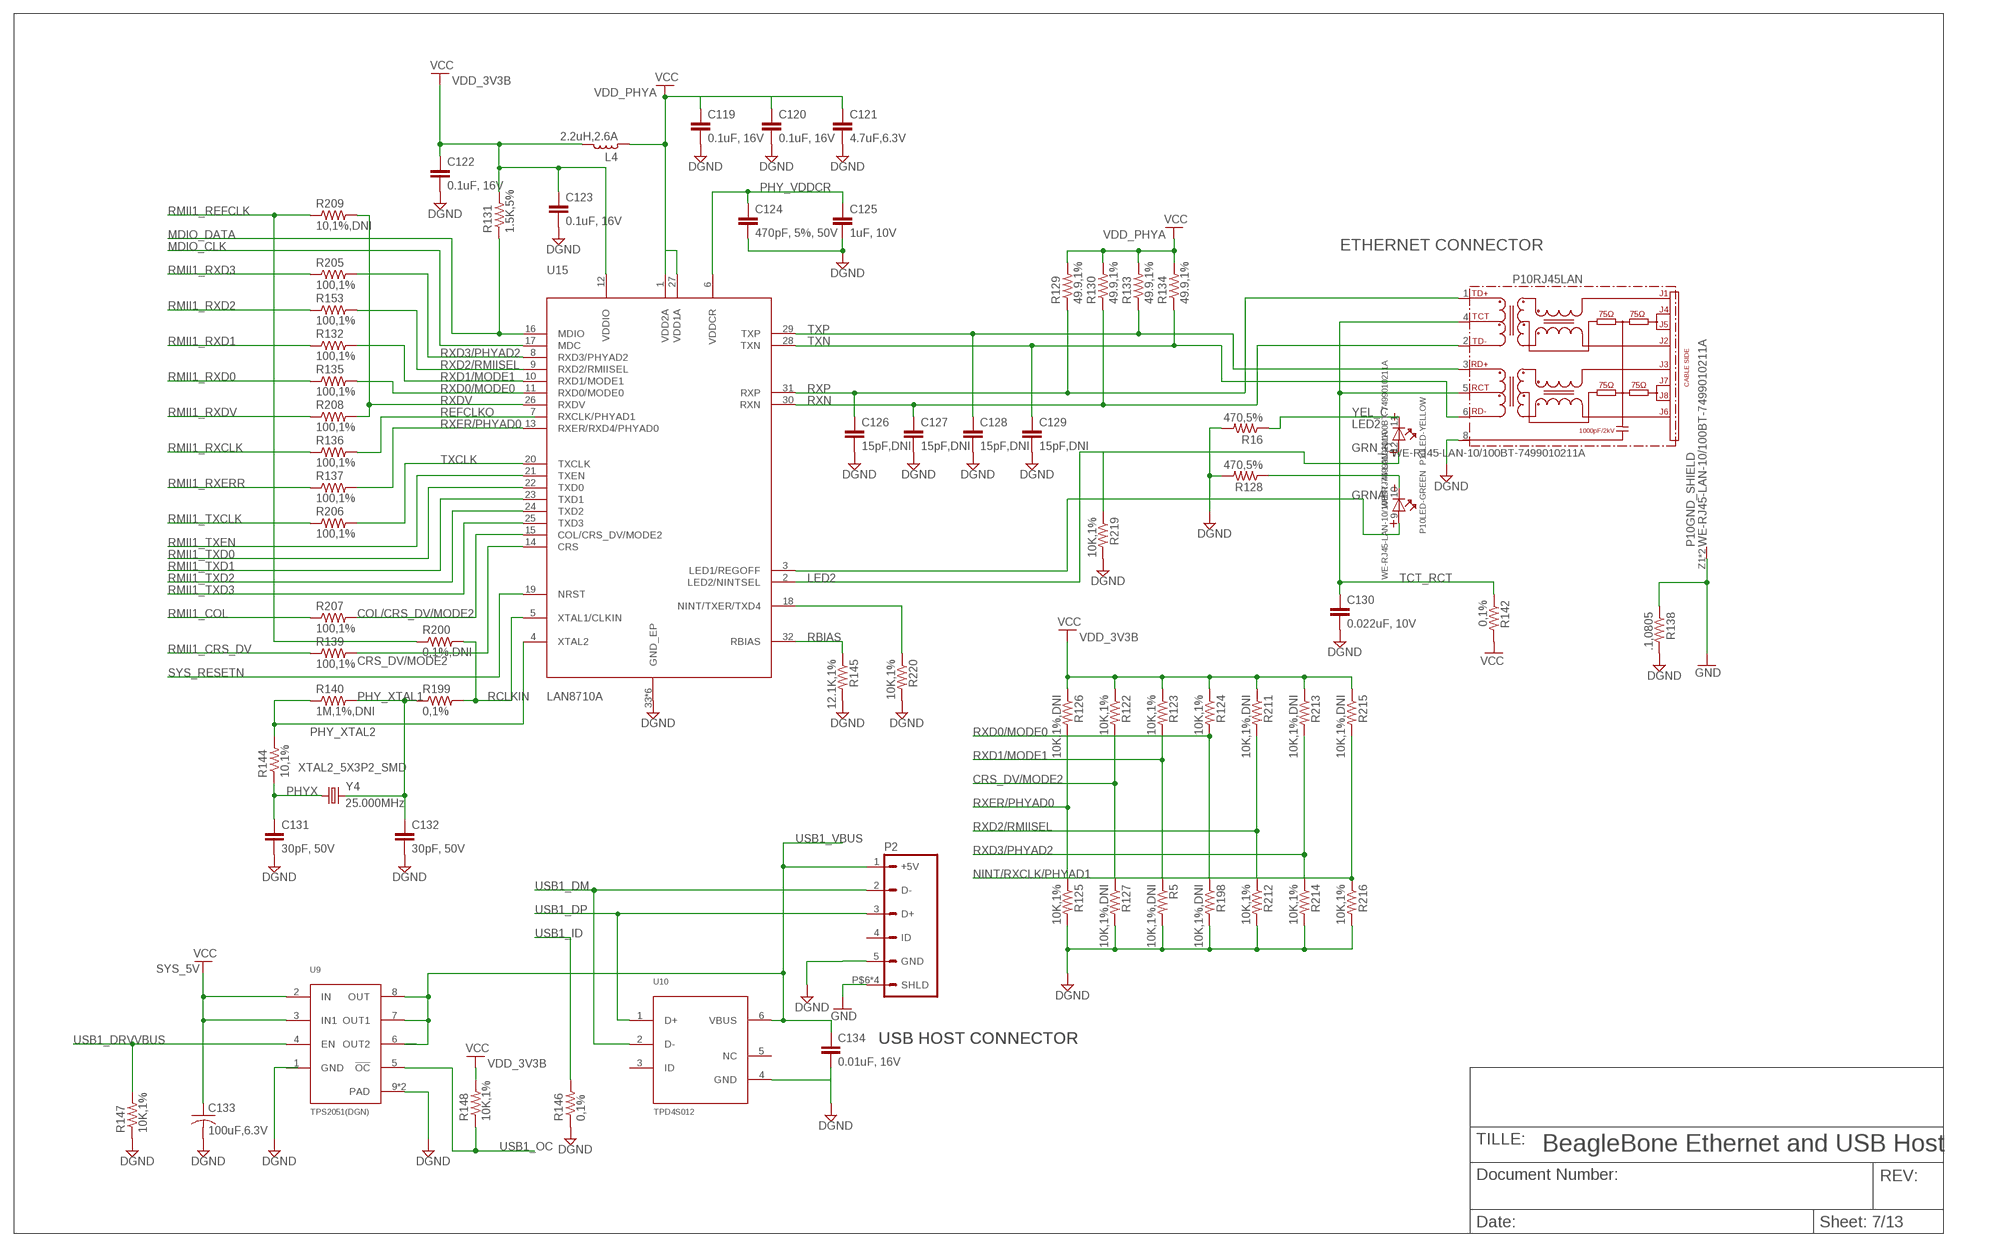
[diagram p8: schematic, sheet 7]

### Parts
C119  0.1uF, 16V  C-EUC0402  [C0402]
C120  0.1uF, 16V  C-EUC0402  [C0402]
C121  4.7uF,6.3V  C-EUC0402  [C0402]
C122  0.1uF, 16V  C-EUC0402  [C0402]
C123  0.1uF, 16V  C-EUC0402  [C0402]
C124  470pF, 5%, 50V  C-EUC0402  [C0402]
C125  1uF, 10V  C-EUC0402  [C0402]
C126  15pF,DNI  C2,5-3  [C2.5-3]
C127  15pF,DNI  C2,5-3  [C2.5-3]
C128  15pF,DNI  C2,5-3  [C2.5-3]
C129  15pF,DNI  C2,5-3  [C2.5-3]
C130  0.022uF, 10V  C-EUC0402  [C0402]
C131  30pF, 50V  C-EUC0402  [C0402]
C132  30pF, 50V  C-EUC0402  [C0402]
C133  100uF,6.3V  C_US_C  [CAP_C]
C134  0.01uF, 16V  C-EUC0402  [C0402]
L4  2.2uH,2.6A  L-USL1008  [L1008]
P2  CON-MINI_USB-A  [MINI-USB-A]
P10  WE-RJ45-LAN-10/100BT-7499010211A  [74990-WITH-LED-TYPE2]
R5  10K,1%,DNI  R-US_R0402  [R0402]
R16  470,5%  R-US_R0402  [R0402]
R122  10K,1%  R-US_R0402  [R0402]
R123  10K,1%  R-US_R0402  [R0402]
R124  10K,1%  R-US_R0402  [R0402]
R125  10K,1%  R-US_R0402  [R0402]
R126  10K,1%,DNI  R-US_R0402  [R0402]
R127  10K,1%,DNI  R-US_R0402  [R0402]
R128  470,5%  R-US_R0402  [R0402]
R129  49.9,1%  R-US_R0402  [R0402]
R130  49.9,1%  R-US_R0402  [R0402]
R131  1.5K,5%  R-US_R0402  [R0402]
R132  100,1%  R-US_R0402  [R0402]
R133  49.9,1%  R-US_R0402  [R0402]
R134  49.9,1%  R-US_R0402  [R0402]
R135  100,1%  R-US_R0402  [R0402]
R136  100,1%  R-US_R0402  [R0402]
R137  100,1%  R-US_R0402  [R0402]
R138  .1,0805  R-US_R0402  [R0402]
R139  100,1%  R-US_R0402  [R0402]
R140  1M,1%,DNI  R-US_R0402  [R0402]
R142  0,1%  R-US_R0402  [R0402]
R144  10,1%  R-US_R0402  [R0402]
R145  12.1K,1%  R-US_R0402  [R0402]
R146  0,1%  R-US_R0402  [R0402]
R147  10K,1%  R-US_R0402  [R0402]
R148  10K,1%  R-US_R0402  [R0402]
R153  100,1%  R-US_R0402  [R0402]
R198  10K,1%,DNI  R-US_R0402  [R0402]
R199  0,1%  R-US_R0402  [R0402]
R200  0,1%,DNI  R-US_R0402  [R0402]
R205  100,1%  R-US_R0402  [R0402]
R206  100,1%  R-US_R0402  [R0402]
R207  100,1%  R-US_R0402  [R0402]
R208  100,1%  R-US_R0402  [R0402]
R209  10,1%,DNI  R-US_R0402  [R0402]
R211  10K,1%,DNI  R-US_R0402  [R0402]
R212  10K,1%  R-US_R0402  [R0402]
R213  10K,1%,DNI  R-US_R0402  [R0402]
R214  10K,1%  R-US_R0402  [R0402]
R215  10K,1%,DNI  R-US_R0402  [R0402]
R216  10K,1%  R-US_R0402  [R0402]
R219  10K,1%  R-US_R0402  [R0402]
R220  10K,1%  R-US_R0402  [R0402]
U9  TPS2051(DGN)  [DGN]
U10  TPD4S012  [DRY(R-PUSON-N6)]
U15  LAN8710A  [32-QFN]
Y4  25.000MHz  CRYSTALHC49S  [HC49/S]

### Nets
COL/CRS_DV/MODE2: R207.2 U15.15(COL/CRS_DV/MODE2)
CRS_DV/MODE2: R122.2 R127.1 R139.2 U15.14(CRS)
DGND: C119.2 C120.2 C121.2 C122.2 C123.2 C124.2 C125.2 C126.2 C127.2 C128.2 C129.2 C130.2 C131.2 C132.2 C133.- C134.2 P2.5(GND) P10.8(RJ45LAN:SH) R5.2 R16.2 R125.2 R127.2 R128.2 R138.2 R145.2 R146.1 R147.1 R198.2 R212.2 R214.2 R216.2 R219.2 R220.2 U9.9(PAD) U9.GND(PAD) U10.4(GND) U15.33(GND_EP) U15.W1(GND_EP) U15.W2(GND_EP) U15.W3(GND_EP) U15.W4(GND_EP) U15.W5(GND_EP) ; also sheet 1,2,3,5,6,8,9,10,11,12,13
GND: P2.P$6(SHLD) P2.P$7(SHLD) P2.P$8(SHLD) P2.P$9(SHLD) P10.Z1 P10.Z2 R138.1 ; also sheet 1,8,10,11
GRN_C: P10.10(LED-GREEN:K) R128.1
GRNA: P10.9(LED-GREEN:A) U15.3(LED1/REGOFF)
LED2: P10.12(LED-YELLOW:A) R219.1 U15.2(LED2/NINTSEL)
MDIO_CLK: U15.17(MDC) ; also sheet 4
MDIO_DATA: R131.1 U15.16(MDIO) ; also sheet 4
N$7: R220.1 U15.18(NINT/TXER/TXD4)
NINT/RXCLK/PHYAD1: R215.2 R216.1
PHY_VDDCR: C124.1 C125.1 U15.6(VDDCR)
PHY_XTAL1: C132.1 R140.2 R199.1 Y4.2
PHY_XTAL2: R140.1 R144.2 U15.4(XTAL2)
PHYX: C131.1 R144.1 Y4.1
RBIAS: R145.1 U15.32(RBIAS)
RCLKIN: R199.2 R200.2 U15.5(XTAL1/CLKIN)
REFCLKO: R136.2
RMII1_COL: R207.1 ; also sheet 4
RMII1_CRS_DV: R139.1 ; also sheet 4
RMII1_REFCLK: R200.1 R209.1 ; also sheet 4
RMII1_RXCLK: R136.1 ; also sheet 4
RMII1_RXD0: R135.1 ; also sheet 4
RMII1_RXD1: R132.1 ; also sheet 4
RMII1_RXD2: R153.1 ; also sheet 4
RMII1_RXD3: R205.1 ; also sheet 4
RMII1_RXDV: R208.1 ; also sheet 4
RMII1_RXERR: R137.1 ; also sheet 4
RMII1_TXCLK: R206.1 ; also sheet 4
RMII1_TXD0: U15.22(TXD0) ; also sheet 4
RMII1_TXD1: U15.23(TXD1) ; also sheet 4
RMII1_TXD2: U15.24(TXD2) ; also sheet 4
RMII1_TXD3: U15.25(TXD3) ; also sheet 4
RMII1_TXEN: U15.21(TXEN) ; also sheet 4
RXD0/MODE0: R124.2 R135.2 R198.1 U15.11(RXD0/MODE0)
RXD1/MODE1: R5.1 R123.2 R132.2 U15.10(RXD1/MODE1)
RXD2/RMIISEL: R153.2 R211.2 R212.1 U15.9(RXD2/RMIISEL)
RXD3/PHYAD2: R205.2 R213.2 R214.1 U15.8(RXD3/PHYAD2)
RXDV: R208.2 R209.2 U15.26(RXDV)
RXER/PHYAD0: R125.1 R126.2 R137.2 U15.13(RXER/RXD4/PHYAD0)
RXN: C127.1 P10.2(RJ45LAN:TD-) R130.1 U15.30(RXN)
RXP: C126.1 P10.1(RJ45LAN:TD+) R129.1 U15.31(RXP)
SYS_5V: C133.+ U9.2(IN) U9.3(IN1) ; supply symbol labelled VCC ; also sheet 1,5,8,10,11
SYS_RESETN: U15.19(NRST) ; also sheet 3,10
TCT_RCT: C130.1 P10.4(RJ45LAN:TCT) P10.5(RJ45LAN:RCT) R142.1
TXCLK: R206.2 U15.20(TXCLK)
TXN: C129.1 P10.6(RJ45LAN:RD-) R134.1 U15.28(TXN)
TXP: C128.1 P10.3(RJ45LAN:RD+) R133.1 U15.29(TXP)
USB1_DM: P2.2(D-) U10.2(D-) ; also sheet 4
USB1_DP: P2.3(D+) U10.1(D+) ; also sheet 4
USB1_DRVVBUS: R147.2 U9.4(EN) ; also sheet 4
USB1_ID: R146.2 ; also sheet 4
USB1_OC: R148.1 U9.5(!OC) ; also sheet 3
USB1_VBUS: C134.1 P2.1(+5V) U9.6(OUT2) U9.7(OUT1) U9.8(OUT) U10.6(VBUS) ; also sheet 4
VCC: R142.2 ; also sheet 9
VDD_3V3B: C122.1 C123.1 L4.1 R122.1 R123.1 R124.1 R126.1 R131.2 R148.2 R211.1 R213.1 R215.1 U15.12(VDDIO) ; supply symbol labelled VCC ; also sheet 1,4,6,8,9,10,11,13
VDD_PHYA: C119.1 C120.1 C121.1 L4.2 R129.2 R130.2 R133.2 R134.2 U15.1(VDD2A) U15.27(VDD1A) ; supply symbol labelled VCC
YEL_C: P10.11(LED-YELLOW:K) R16.1
Unconnected: P2.4(ID) P10.7(NC:NC) U9.1(GND) U10.3(ID) U10.5(NC) U15.7(RXCLK/PHYAD1)

### Notes on the sheet
- ETHERNET CONNECTOR
- XTAL2_5X3P2_SMD
- USB HOST CONNECTOR | USB HOST CONNECTOR
- TILLE:
- BeagleBone Ethernet and USB Host
- Document Number: | REV:
- Date: | Sheet: 7/13